# Altium project QUTMS_Shutdownboard_V2.PrjPcb (part 1 of 2)
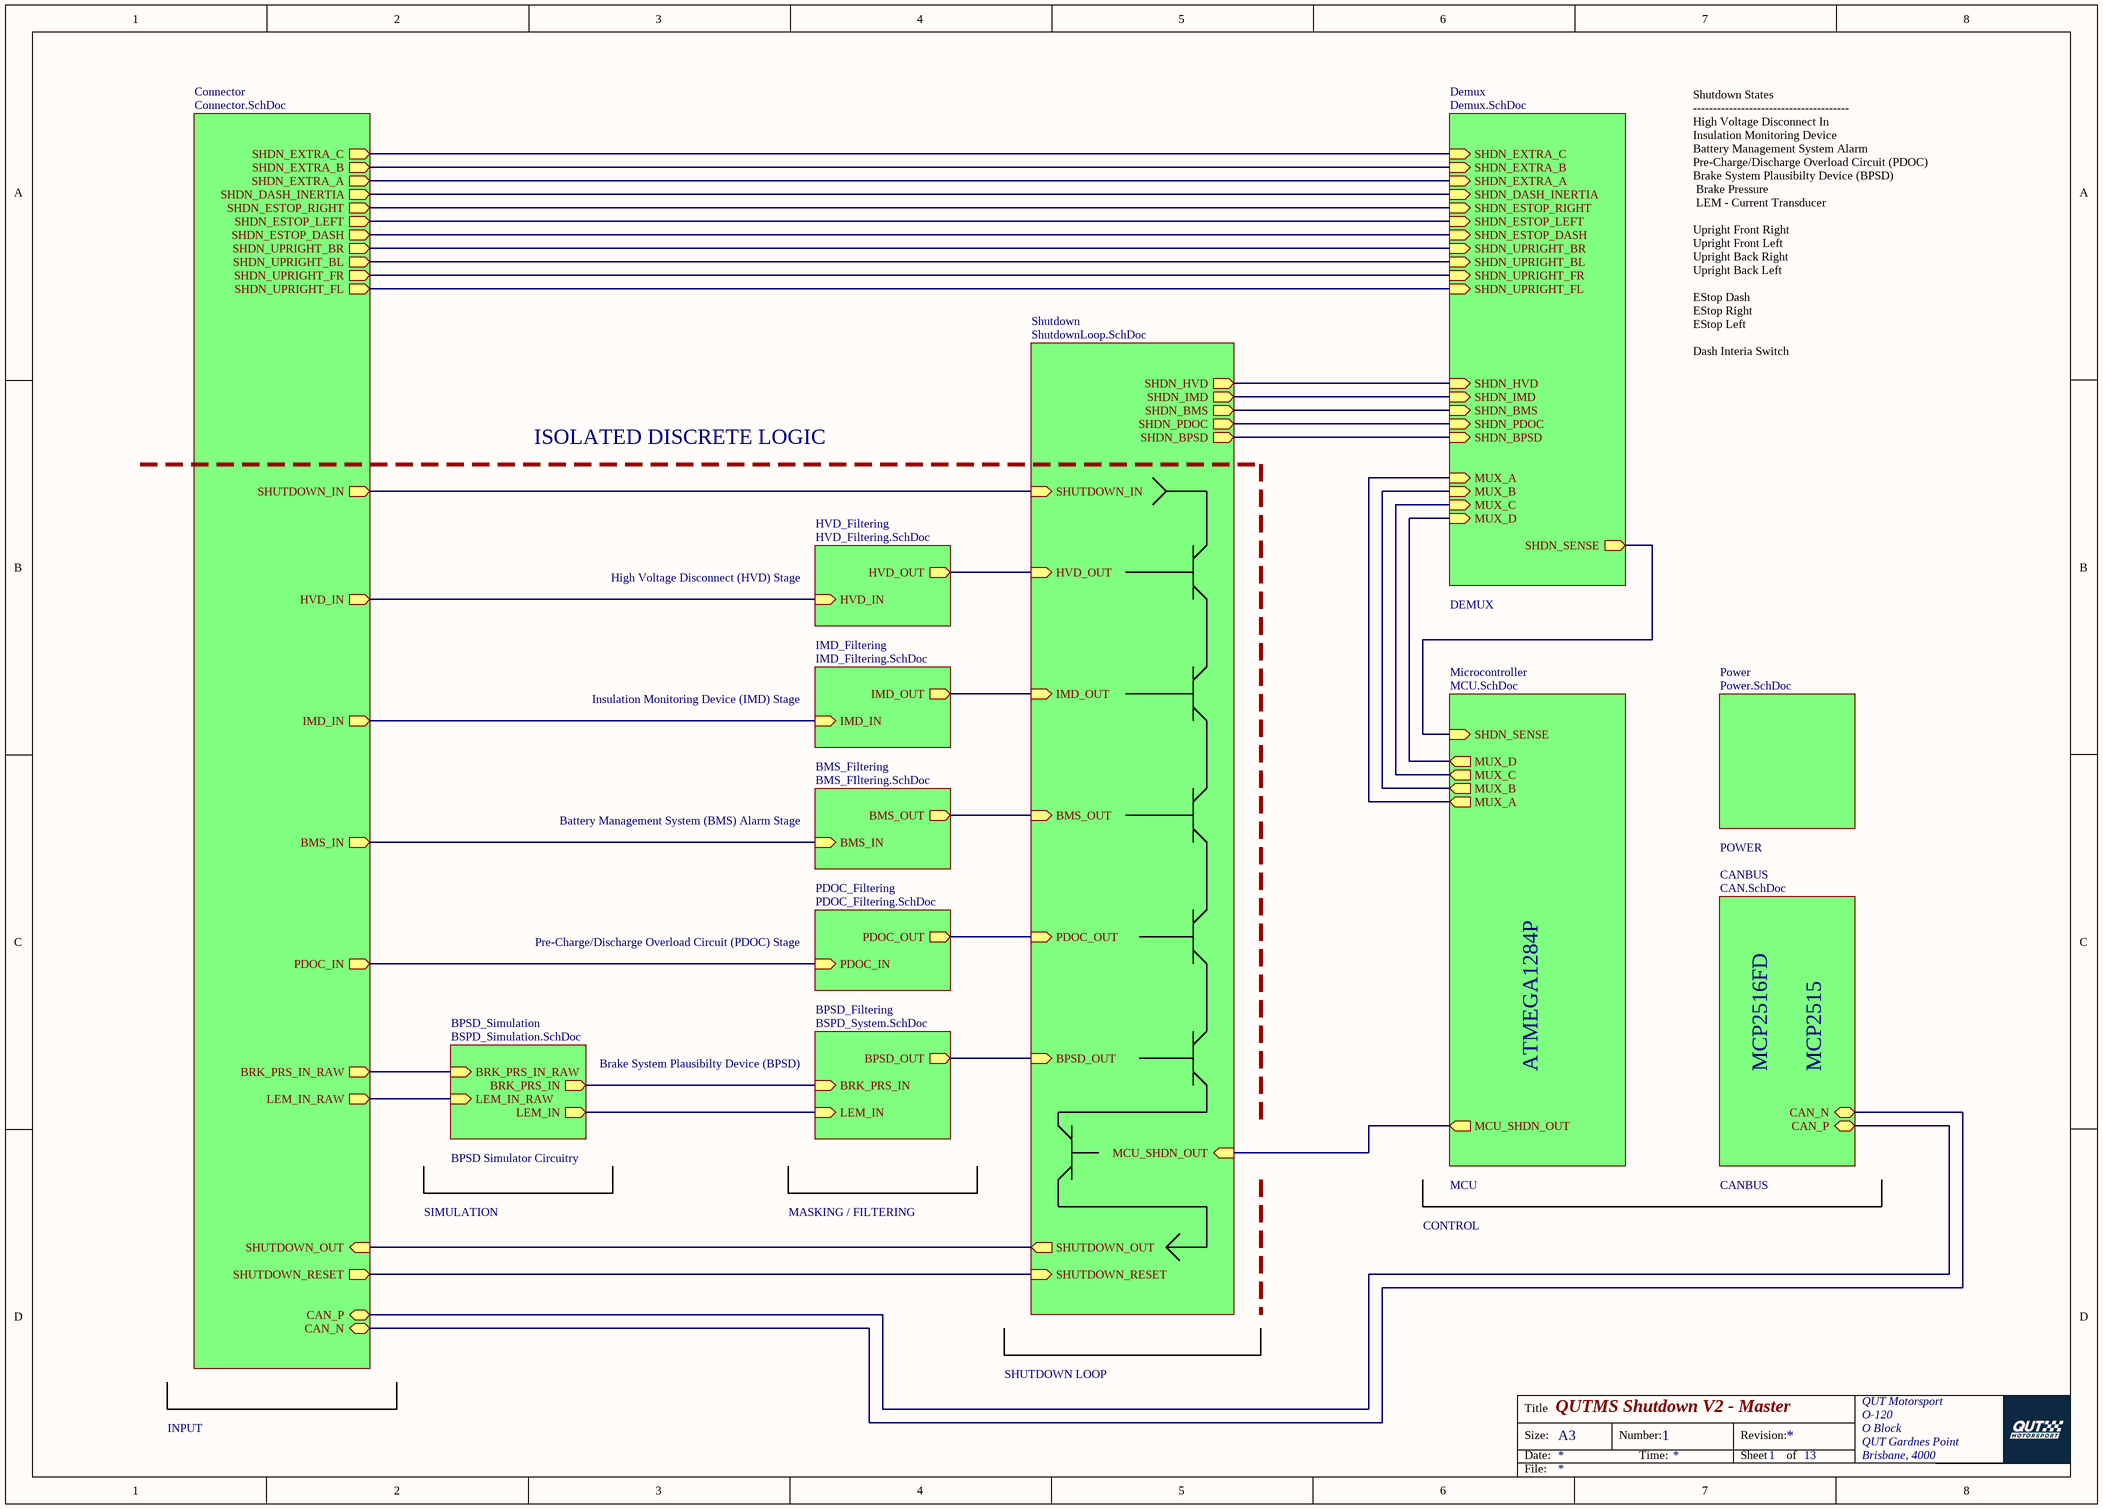
[diagram p0: Master.SchDoc]
13 sheets, 127 parts. Net scope: hierarchical (ports join the sheet entries above them; power ports are global).
Board file: ShutdownBoard.PcbDoc
Sheets:
  Master.SchDoc
    HVD_Filtering = HVD_Filtering.SchDoc
    IMD_Filtering = IMD_Filtering.SchDoc
    BMS_Filtering = BMS_FIltering.SchDoc
    PDOC_Filtering = PDOC_Filtering.SchDoc
    BPSD_Filtering = BSPD_System.SchDoc
    BPSD_Simulation = BSPD_Simulation.SchDoc
    Connector = Connector.SchDoc
    Shutdown = ShutdownLoop.SchDoc
    Microcontroller = MCU.SchDoc
    CANBUS = CAN.SchDoc
    Power = Power.SchDoc
    Demux = Demux.SchDoc

## Sheet Master.SchDoc: QUTMS Shutdown V2 - Master
size A3; Organization: QUT Motorsport; Address1: O-120; Address2: O Block; Address3: QUT Gardnes Point; Address4: Brisbane, 4000; DocumentNumber: 1; SheetNumber: 1; SheetTotal: 13

### Sub-sheets
BMS_Filtering = BMS_FIltering.SchDoc: BMS_OUT (out), BMS_IN (in)
BPSD_Filtering = BSPD_System.SchDoc: BPSD_OUT (out), BRK_PRS_IN (in), LEM_IN (in)
BPSD_Simulation = BSPD_Simulation.SchDoc: LEM_IN (out), BRK_PRS_IN (out), BRK_PRS_IN_RAW (in), LEM_IN_RAW (in)
CANBUS = CAN.SchDoc: CAN_P (bidir), CAN_N (bidir)
Connector = Connector.SchDoc: LEM_IN_RAW (out), BRK_PRS_IN_RAW (out), PDOC_IN (out), BMS_IN (out), IMD_IN (out), HVD_IN (out), SHUTDOWN_IN (out), SHUTDOWN_OUT (in), SHUTDOWN_RESET (out), SHDN_UPRIGHT_FL (out), SHDN_UPRIGHT_FR (out), SHDN_UPRIGHT_BL (out), SHDN_UPRIGHT_BR (out), SHDN_ESTOP_LEFT (out), SHDN_ESTOP_RIGHT (out), SHDN_DASH_INERTIA (out), SHDN_EXTRA_B (out), SHDN_EXTRA_A (out), SHDN_ESTOP_DASH (out), SHDN_EXTRA_C (out), CAN_N (bidir), CAN_P (bidir)
Demux = Demux.SchDoc: SHDN_EXTRA_C (in), SHDN_EXTRA_B (in), SHDN_EXTRA_A (in), SHDN_DASH_INERTIA (in), SHDN_ESTOP_RIGHT (in), SHDN_ESTOP_LEFT (in), SHDN_ESTOP_DASH (in), SHDN_UPRIGHT_BR (in), SHDN_UPRIGHT_BL (in), SHDN_UPRIGHT_FR (in), SHDN_UPRIGHT_FL (in), SHDN_HVD (in), SHDN_IMD (in), SHDN_BMS (in), SHDN_PDOC (in), SHDN_BPSD (in), SHDN_SENSE (out), MUX_D (in), MUX_C (in), MUX_B (in), MUX_A (in)
HVD_Filtering = HVD_Filtering.SchDoc: HVD_OUT (out), HVD_IN (in)
IMD_Filtering = IMD_Filtering.SchDoc: IMD_OUT (out), IMD_IN (in)
Microcontroller = MCU.SchDoc: SHDN_SENSE (in), MUX_D (out), MUX_C (out), MUX_B (out), MUX_A (out), MCU_SHDN_OUT (out)
PDOC_Filtering = PDOC_Filtering.SchDoc: PDOC_OUT (out), PDOC_IN (in)
Power = Power.SchDoc: no entries
Shutdown = ShutdownLoop.SchDoc: HVD_OUT (in), IMD_OUT (in), BMS_OUT (in), PDOC_OUT (in), BPSD_OUT (in), SHUTDOWN_IN (in), SHUTDOWN_OUT (out), SHUTDOWN_RESET (in), SHDN_HVD (out), SHDN_IMD (out), SHDN_BMS (out), SHDN_PDOC (out), SHDN_BPSD (out), MCU_SHDN_OUT (in)

### Nets
BMS_IN: sheet BMS_Filtering/BMS_IN, sheet Connector/BMS_IN
BRK_PRS_IN_RAW: sheet BPSD_Simulation/BRK_PRS_IN_RAW, sheet Connector/BRK_PRS_IN_RAW
CAN_N: sheet Connector/CAN_N, sheet CANBUS/CAN_N
CAN_P: sheet Connector/CAN_P, sheet CANBUS/CAN_P
HVD_IN: sheet HVD_Filtering/HVD_IN, sheet Connector/HVD_IN
IMD_IN: sheet IMD_Filtering/IMD_IN, sheet Connector/IMD_IN
LEM_IN_RAW: sheet BPSD_Simulation/LEM_IN_RAW, sheet Connector/LEM_IN_RAW
PDOC_IN: sheet PDOC_Filtering/PDOC_IN, sheet Connector/PDOC_IN
SHDN_BMS: sheet Shutdown/SHDN_BMS, sheet Demux/SHDN_BMS
SHDN_BPSD: sheet Shutdown/SHDN_BPSD, sheet Demux/SHDN_BPSD
SHDN_DASH_INERTIA: sheet Connector/SHDN_DASH_INERTIA, sheet Demux/SHDN_DASH_INERTIA
SHDN_ESTOP_DASH: sheet Connector/SHDN_ESTOP_DASH, sheet Demux/SHDN_ESTOP_DASH
SHDN_ESTOP_LEFT: sheet Connector/SHDN_ESTOP_LEFT, sheet Demux/SHDN_ESTOP_LEFT
SHDN_ESTOP_RIGHT: sheet Connector/SHDN_ESTOP_RIGHT, sheet Demux/SHDN_ESTOP_RIGHT
SHDN_EXTRA_A: sheet Connector/SHDN_EXTRA_A, sheet Demux/SHDN_EXTRA_A
SHDN_EXTRA_B: sheet Connector/SHDN_EXTRA_B, sheet Demux/SHDN_EXTRA_B
SHDN_EXTRA_C: sheet Connector/SHDN_EXTRA_C, sheet Demux/SHDN_EXTRA_C
SHDN_HVD: sheet Shutdown/SHDN_HVD, sheet Demux/SHDN_HVD
SHDN_IMD: sheet Shutdown/SHDN_IMD, sheet Demux/SHDN_IMD
SHDN_PDOC: sheet Shutdown/SHDN_PDOC, sheet Demux/SHDN_PDOC
SHDN_UPRIGHT_BL: sheet Connector/SHDN_UPRIGHT_BL, sheet Demux/SHDN_UPRIGHT_BL
SHDN_UPRIGHT_BR: sheet Connector/SHDN_UPRIGHT_BR, sheet Demux/SHDN_UPRIGHT_BR
SHDN_UPRIGHT_FL: sheet Connector/SHDN_UPRIGHT_FL, sheet Demux/SHDN_UPRIGHT_FL
SHDN_UPRIGHT_FR: sheet Connector/SHDN_UPRIGHT_FR, sheet Demux/SHDN_UPRIGHT_FR
SHUTDOWN_IN: sheet Connector/SHUTDOWN_IN, sheet Shutdown/SHUTDOWN_IN
SHUTDOWN_OUT: sheet Connector/SHUTDOWN_OUT, sheet Shutdown/SHUTDOWN_OUT
SHUTDOWN_RESET: sheet Connector/SHUTDOWN_RESET, sheet Shutdown/SHUTDOWN_RESET
NetC1_2: sheet BPSD_Filtering/BRK_PRS_IN, sheet BPSD_Simulation/BRK_PRS_IN
NetC3_2: sheet BPSD_Filtering/LEM_IN, sheet BPSD_Simulation/LEM_IN
NetK1_21: sheet HVD_Filtering/HVD_OUT, sheet Shutdown/HVD_OUT
NetK2_21: sheet IMD_Filtering/IMD_OUT, sheet Shutdown/IMD_OUT
NetK3_21: sheet BMS_Filtering/BMS_OUT, sheet Shutdown/BMS_OUT
NetK4_21: sheet PDOC_Filtering/PDOC_OUT, sheet Shutdown/PDOC_OUT
NetK5_21: sheet BPSD_Filtering/BPSD_OUT, sheet Shutdown/BPSD_OUT
NetK6_21: sheet Shutdown/MCU_SHDN_OUT, sheet Microcontroller/MCU_SHDN_OUT
NetR27_1: sheet Microcontroller/SHDN_SENSE, sheet Demux/SHDN_SENSE
NetU5_10: sheet Microcontroller/MUX_A, sheet Demux/MUX_A
NetU5_11: sheet Microcontroller/MUX_B, sheet Demux/MUX_B
NetU5_13: sheet Microcontroller/MUX_D, sheet Demux/MUX_D
NetU5_14: sheet Microcontroller/MUX_C, sheet Demux/MUX_C

### Notes on the sheet
- Shutdown States
  ---------------------------------------
  High Voltage Disconnect In
  Insulation Monitoring Device
  Battery Management System Alarm
  Pre-Charge/Discharge Overload Circuit (PDOC)
  Brake System Plausibilty Device (BPSD)
  Brake Pressure
  LEM - Current Transducer
  Upright Front Right
  Upright Front Left
  Upright Back Right
  Upright Back Left
  EStop Dash
  EStop Right
  EStop Left
  Dash Interia Switch
- ISOLATED DISCRETE LOGIC
- High Voltage Disconnect (HVD) Stage
- DEMUX
- Insulation Monitoring Device (IMD) Stage
- Battery Management System (BMS) Alarm Stage
- POWER
- Pre-Charge/Discharge Overload Circuit (PDOC) Stage
- Brake System Plausibilty Device (BPSD)
- ATMEGA1284P
- MCP2516FD
- MCP2515
- BPSD Simulator Circuitry
- MCU
- CANBUS
- SIMULATION
- MASKING / FILTERING
- CONTROL
- SHUTDOWN LOOP
- INPUT
- Title
- Size:
- Date:
- A3
- Number:
- Time:
- Revision:
- Sheet
- of
- File:

## Sheet HVD_Filtering.SchDoc: QUTMS Shutdown V2 - HVD_Filtering
size A4; Author: Jonn Dillon; Organization: QUT Motorsport; Address1: O-120; Address2: O Block; Address3: QUT Gardens Point; Address4: Brisbane, 4000; DocumentNumber: 5; SheetNumber: 5; SheetTotal: 13
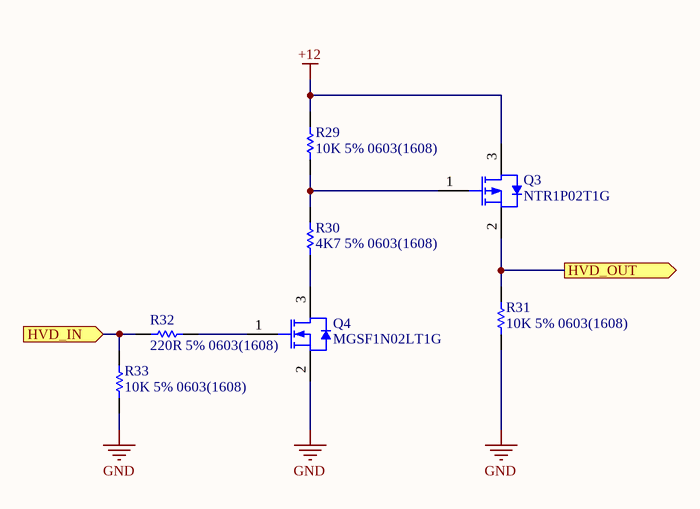
[diagram p1: HVD_Filtering.SchDoc]

### Parts
Q3  NTR1P02T1G  [ONSC-SOT-23-3-318-08_V]
Q4  MGSF1N02LT1G  [ONSC-SOT-23-3-318-08_V]
R29  10K 5% 0603(1608)  [RESC0603(1608)_N]
R30  4K7 5% 0603(1608)  [RESC0603(1608)_N]
R31  10K 5% 0603(1608)  [RESC0603(1608)_N]
R32  220R 5% 0603(1608)  [RESC0603(1608)_M]
R33  10K 5% 0603(1608)  [RESC0603(1608)_N]

### Ports
HVD_IN (in), HVD_OUT (out)

### Nets
+12: Q3.3(D) R29.2
GND: Q4.2(S) R31.1 R33.1
HVD_IN: R32.1 R33.2 ; port HVD_IN
NetK1_21: Q3.2(S) R31.2 ; port HVD_OUT
NetQ3_1: Q3.1(G) R29.1 R30.2
NetQ4_1: Q4.1(G) R32.2
NetQ4_3: Q4.3(D) R30.1

### Notes on the sheet
- Title
- Size:
- Date:
- A4
- Number:
- Time:
- Revision:
- Sheet
- of
- File:

### Library data of the parts
Q3 = CMP-1058-00751-1: Power MOSFET, -20 V, -1 A, P-Channel, 3-Pin SOT-23, Pb-Free, Tape and Reel; Manufacturer: On Semiconductor; Ciss Typ (pF): 165; Coss Typ (pF): 110; Qrr Typ (nC): 8; Crss Typ (pF): 35; V(BR)DSS Min (V): 20; VGS(th) Max (V): 2.3; Configuration: Single; ID Max (A): 1; Channel Polarity: P Channel; PD Max (W): 0.4; ComponentLink2Description: Datasheet; ComponentLink3URL: http://www.onsemi.cn/pub_link/Collateral/318-08.PDF; PackageReference: SOT-23-3-318-08; ComponentLink1Description: Manufacturer URL; Mounting Technology: Surface Mount; RoHS: Pb-Free; Package Type: SOT-23-3; DatasheetVersion: Rev. 7; PackageVersion: Rev. AP, 11/2009; Packing: Tape and Reel; PackageDescription: 3-Pin Small Outline Transistor, Body 2.92 x 1.3 mm, Pitch 0.95 mm; VGS Max (V): 20; ComponentLink3Description: Package Specification; ComponentLink1URL: http://www.onsemi.com/; PartNumber: NTR1P02T1G; ComponentLink2URL: http://www.onsemi.cn/pub_link/Collateral/NTR1P02T1-D.PDF
Q4 = CMP-1058-00777-1: Power MOSFET, 750 mA, 20 V, N-Channel, 3-Pin SOT-23, Pb-Free, Tape and Reel; Manufacturer: On Semiconductor; Crss Typ (pF): 45; Ciss Typ (pF): 125; VGS(th) Max (V): 2.4; Coss Typ (pF): 120; PD Max (W): 0.4; VGS Max (V): 20; Configuration: Single; Channel Polarity: N Channel; ID Max (A): 0.75; PackageReference: SOT-23-3-318-08; ComponentLink2Description: Datasheet; PackageVersion: Rev. AP, 11/2009; ComponentLink1URL: http://www.onsemi.com/; RoHS: Pb-Free; Mounting Technology: Surface Mount; Package Type: SOT-23-3; ComponentLink1Description: Manufacturer URL; V(BR)DSS Min (V): 20; PackageDescription: 3-Pin Small Outline Transistor, Body 2.92 x 1.3 mm, Pitch 0.95 mm; Packing: Tape and Reel; PartNumber: MGSF1N02LT1G; DatasheetVersion: Rev. 6; ComponentLink2URL: http://www.onsemi.cn/pub_link/Collateral/MGSF1N02LT1-D.PDF; ComponentLink3URL: http://www.onsemi.cn/pub_link/Collateral/318-08.PDF; ComponentLink3Description: Package Specification
R29 R31 R33 = CMP-1012-00098-1: 10K 0.1W 5% 0603 (1608 Metric)  SMD; Case-EIA: 0603; Value: 10000.00 Ohm; Case-Metric: 1608; Technology: SMT; Tolerance: 5 %; Power: 0.1 W
R30 = CMP-1012-00090-1: 4K7 0.1W 5% 0603 (1608 Metric)  SMD; Case-Metric: 1608; Value: 4700.00 Ohm; Case-EIA: 0603; Tolerance: 5 %; Technology: SMT; Power: 0.1 W
R32 = CMP-1012-00058-1: 220R 0.1W 5% 0603 (1608 Metric)  SMD; Case-EIA: 0603; Case-Metric: 1608; Value: 220.00 Ohm; Technology: SMT; Power: 0.1 W; Tolerance: 5 %

## Sheet IMD_Filtering.SchDoc: QUTMS Shutdown V2 - IMD_Filtering
size A4; Author: Jonn Dillon; Organization: QUT Motorsport; Address1: O-120; Address2: O Block; Address3: QUT Gardens Point; Address4: Brisbane, 4000; DocumentNumber: 6; SheetNumber: 6; SheetTotal: 13
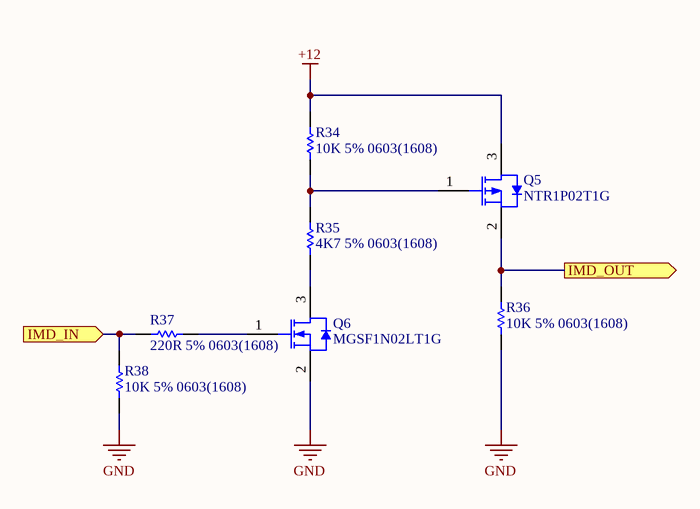
[diagram p2: IMD_Filtering.SchDoc]

### Parts
Q5  NTR1P02T1G  [ONSC-SOT-23-3-318-08_V]
Q6  MGSF1N02LT1G  [ONSC-SOT-23-3-318-08_V]
R34  10K 5% 0603(1608)  [RESC0603(1608)_N]
R35  4K7 5% 0603(1608)  [RESC0603(1608)_N]
R36  10K 5% 0603(1608)  [RESC0603(1608)_N]
R37  220R 5% 0603(1608)  [RESC0603(1608)_M]
R38  10K 5% 0603(1608)  [RESC0603(1608)_N]

### Ports
IMD_IN (in), IMD_OUT (out)

### Nets
+12: Q5.3(D) R34.2
GND: Q6.2(S) R36.1 R38.1
IMD_IN: R37.1 R38.2 ; port IMD_IN
NetK2_21: Q5.2(S) R36.2 ; port IMD_OUT
NetQ5_1: Q5.1(G) R34.1 R35.2
NetQ6_1: Q6.1(G) R37.2
NetQ6_3: Q6.3(D) R35.1

### Notes on the sheet
- Title
- Size:
- Date:
- A4
- Number:
- Time:
- Revision:
- Sheet
- of
- File:

### Library data of the parts
Q5 = CMP-1058-00751-1: as Q3 on sheet HVD_Filtering; ComponentLink2Description: Datasheet; ComponentLink3URL: http://www.onsemi.cn/pub_link/Collateral/318-08.PDF; PackageReference: SOT-23-3-318-08; ComponentLink1Description: Manufacturer URL; Mounting Technology: Surface Mount; RoHS: Pb-Free; Package Type: SOT-23-3; DatasheetVersion: Rev. 7; PackageVersion: Rev. AP, 11/2009; Packing: Tape and Reel; PackageDescription: 3-Pin Small Outline Transistor, Body 2.92 x 1.3 mm, Pitch 0.95 mm; VGS Max (V): 20; ComponentLink3Description: Package Specification; ComponentLink1URL: http://www.onsemi.com/; PartNumber: NTR1P02T1G; ComponentLink2URL: http://www.onsemi.cn/pub_link/Collateral/NTR1P02T1-D.PDF
Q6 = CMP-1058-00777-1: as Q4 on sheet HVD_Filtering; PackageReference: SOT-23-3-318-08; ComponentLink2Description: Datasheet; PackageVersion: Rev. AP, 11/2009; ComponentLink1URL: http://www.onsemi.com/; RoHS: Pb-Free; Mounting Technology: Surface Mount; Package Type: SOT-23-3; ComponentLink1Description: Manufacturer URL; V(BR)DSS Min (V): 20; PackageDescription: 3-Pin Small Outline Transistor, Body 2.92 x 1.3 mm, Pitch 0.95 mm; Packing: Tape and Reel; PartNumber: MGSF1N02LT1G; DatasheetVersion: Rev. 6; ComponentLink2URL: http://www.onsemi.cn/pub_link/Collateral/MGSF1N02LT1-D.PDF; ComponentLink3URL: http://www.onsemi.cn/pub_link/Collateral/318-08.PDF; ComponentLink3Description: Package Specification
R34 R36 R38 = CMP-1012-00098-1: as R29 on sheet HVD_Filtering; Technology: SMT; Tolerance: 5 %; Power: 0.1 W
R35 = CMP-1012-00090-1: as R30 on sheet HVD_Filtering; Tolerance: 5 %; Technology: SMT; Power: 0.1 W
R37 = CMP-1012-00058-1: as R32 on sheet HVD_Filtering; Technology: SMT; Power: 0.1 W; Tolerance: 5 %

## Sheet BMS_FIltering.SchDoc: QUTMS Shutdown V2 - BMS_Filtering
size A4; Author: Jonn Dillon; Organization: QUT Motorsport; Address1: O-120; Address2: O Block; Address3: QUT Gardens Point; Address4: Brisbane, 4000; DocumentNumber: 7; SheetNumber: 7; SheetTotal: 13
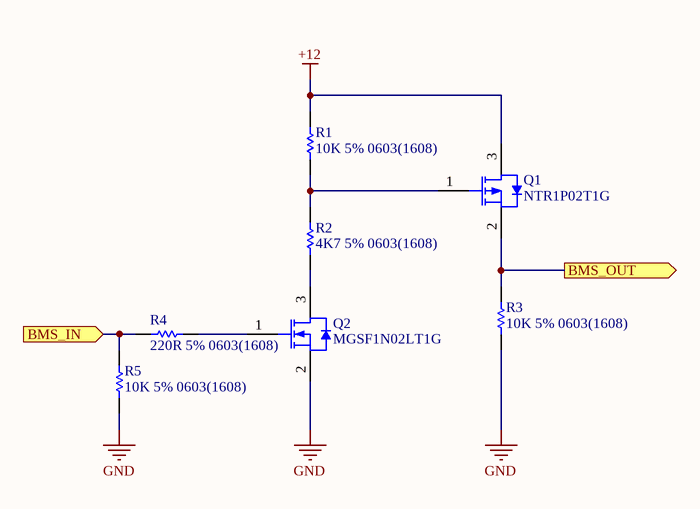
[diagram p3: BMS_FIltering.SchDoc]

### Parts
Q1  NTR1P02T1G  [ONSC-SOT-23-3-318-08_V]
Q2  MGSF1N02LT1G  [ONSC-SOT-23-3-318-08_V]
R1  10K 5% 0603(1608)  [RESC0603(1608)_N]
R2  4K7 5% 0603(1608)  [RESC0603(1608)_N]
R3  10K 5% 0603(1608)  [RESC0603(1608)_N]
R4  220R 5% 0603(1608)  [RESC0603(1608)_M]
R5  10K 5% 0603(1608)  [RESC0603(1608)_N]

### Ports
BMS_IN (in), BMS_OUT (out)

### Nets
+12: Q1.3(D) R1.2
GND: Q2.2(S) R3.1 R5.1
BMS_IN: R4.1 R5.2 ; port BMS_IN
NetK3_21: Q1.2(S) R3.2 ; port BMS_OUT
NetQ1_1: Q1.1(G) R1.1 R2.2
NetQ2_1: Q2.1(G) R4.2
NetQ2_3: Q2.3(D) R2.1

### Notes on the sheet
- Title
- Size:
- Date:
- A4
- Number:
- Time:
- Revision:
- Sheet
- of
- File:

### Library data of the parts
Q1 = CMP-1058-00751-1: as Q3 on sheet HVD_Filtering; ComponentLink2Description: Datasheet; ComponentLink3URL: http://www.onsemi.cn/pub_link/Collateral/318-08.PDF; PackageReference: SOT-23-3-318-08; ComponentLink1Description: Manufacturer URL; Mounting Technology: Surface Mount; RoHS: Pb-Free; Package Type: SOT-23-3; DatasheetVersion: Rev. 7; PackageVersion: Rev. AP, 11/2009; Packing: Tape and Reel; PackageDescription: 3-Pin Small Outline Transistor, Body 2.92 x 1.3 mm, Pitch 0.95 mm; VGS Max (V): 20; ComponentLink3Description: Package Specification; ComponentLink1URL: http://www.onsemi.com/; PartNumber: NTR1P02T1G; ComponentLink2URL: http://www.onsemi.cn/pub_link/Collateral/NTR1P02T1-D.PDF
Q2 = CMP-1058-00777-1: as Q4 on sheet HVD_Filtering; PackageReference: SOT-23-3-318-08; ComponentLink2Description: Datasheet; PackageVersion: Rev. AP, 11/2009; ComponentLink1URL: http://www.onsemi.com/; RoHS: Pb-Free; Mounting Technology: Surface Mount; Package Type: SOT-23-3; ComponentLink1Description: Manufacturer URL; V(BR)DSS Min (V): 20; PackageDescription: 3-Pin Small Outline Transistor, Body 2.92 x 1.3 mm, Pitch 0.95 mm; Packing: Tape and Reel; PartNumber: MGSF1N02LT1G; DatasheetVersion: Rev. 6; ComponentLink2URL: http://www.onsemi.cn/pub_link/Collateral/MGSF1N02LT1-D.PDF; ComponentLink3URL: http://www.onsemi.cn/pub_link/Collateral/318-08.PDF; ComponentLink3Description: Package Specification
R1 R3 R5 = CMP-1012-00098-1: as R29 on sheet HVD_Filtering; Technology: SMT; Tolerance: 5 %; Power: 0.1 W
R2 = CMP-1012-00090-1: as R30 on sheet HVD_Filtering; Tolerance: 5 %; Technology: SMT; Power: 0.1 W
R4 = CMP-1012-00058-1: as R32 on sheet HVD_Filtering; Technology: SMT; Power: 0.1 W; Tolerance: 5 %

## Sheet PDOC_Filtering.SchDoc: QUTMS Shutdown V2 - PDOC_Filtering
size A4; Author: Jonn Dillon; Organization: QUT Motorsport; Address1: O-120; Address2: O Block; Address3: QUT Gardens Point; Address4: Brisbane, 4000; DocumentNumber: 8; SheetNumber: 8; SheetTotal: 13
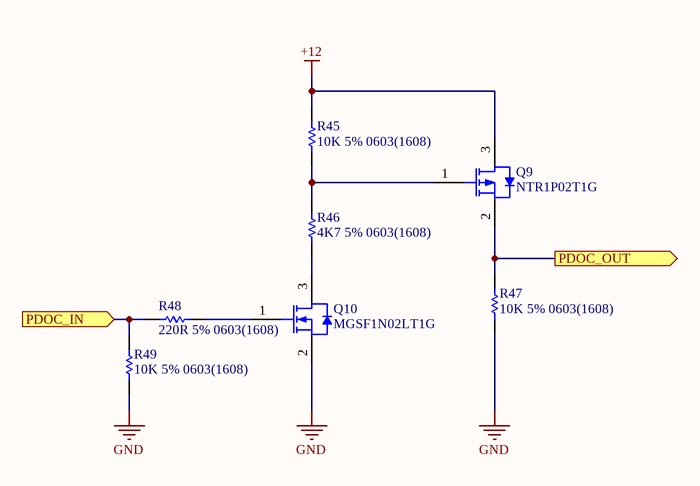
[diagram p4: PDOC_Filtering.SchDoc]

### Parts
Q9  NTR1P02T1G  [ONSC-SOT-23-3-318-08_V]
Q10  MGSF1N02LT1G  [ONSC-SOT-23-3-318-08_V]
R45  10K 5% 0603(1608)  [RESC0603(1608)_N]
R46  4K7 5% 0603(1608)  [RESC0603(1608)_N]
R47  10K 5% 0603(1608)  [RESC0603(1608)_N]
R48  220R 5% 0603(1608)  [RESC0603(1608)_M]
R49  10K 5% 0603(1608)  [RESC0603(1608)_N]

### Ports
PDOC_IN (in), PDOC_OUT (out)

### Nets
+12: Q9.3(D) R45.2
GND: Q10.2(S) R47.1 R49.1
PDOC_IN: R48.1 R49.2 ; port PDOC_IN
NetK4_21: Q9.2(S) R47.2 ; port PDOC_OUT
NetQ9_1: Q9.1(G) R45.1 R46.2
NetQ10_1: Q10.1(G) R48.2
NetQ10_3: Q10.3(D) R46.1

### Notes on the sheet
- Title
- Size:
- Date:
- A4
- Number:
- Time:
- Revision:
- Sheet
- of
- File:

### Library data of the parts
Q9 = CMP-1058-00751-1: as Q3 on sheet HVD_Filtering; ComponentLink2Description: Datasheet; ComponentLink3URL: http://www.onsemi.cn/pub_link/Collateral/318-08.PDF; PackageReference: SOT-23-3-318-08; ComponentLink1Description: Manufacturer URL; Mounting Technology: Surface Mount; RoHS: Pb-Free; Package Type: SOT-23-3; DatasheetVersion: Rev. 7; PackageVersion: Rev. AP, 11/2009; Packing: Tape and Reel; PackageDescription: 3-Pin Small Outline Transistor, Body 2.92 x 1.3 mm, Pitch 0.95 mm; VGS Max (V): 20; ComponentLink3Description: Package Specification; ComponentLink1URL: http://www.onsemi.com/; PartNumber: NTR1P02T1G; ComponentLink2URL: http://www.onsemi.cn/pub_link/Collateral/NTR1P02T1-D.PDF
Q10 = CMP-1058-00777-1: as Q4 on sheet HVD_Filtering; PackageReference: SOT-23-3-318-08; ComponentLink2Description: Datasheet; PackageVersion: Rev. AP, 11/2009; ComponentLink1URL: http://www.onsemi.com/; RoHS: Pb-Free; Mounting Technology: Surface Mount; Package Type: SOT-23-3; ComponentLink1Description: Manufacturer URL; V(BR)DSS Min (V): 20; PackageDescription: 3-Pin Small Outline Transistor, Body 2.92 x 1.3 mm, Pitch 0.95 mm; Packing: Tape and Reel; PartNumber: MGSF1N02LT1G; DatasheetVersion: Rev. 6; ComponentLink2URL: http://www.onsemi.cn/pub_link/Collateral/MGSF1N02LT1-D.PDF; ComponentLink3URL: http://www.onsemi.cn/pub_link/Collateral/318-08.PDF; ComponentLink3Description: Package Specification
R45 R47 R49 = CMP-1012-00098-1: as R29 on sheet HVD_Filtering; Technology: SMT; Tolerance: 5 %; Power: 0.1 W
R46 = CMP-1012-00090-1: as R30 on sheet HVD_Filtering; Tolerance: 5 %; Technology: SMT; Power: 0.1 W
R48 = CMP-1012-00058-1: as R32 on sheet HVD_Filtering; Technology: SMT; Power: 0.1 W; Tolerance: 5 %

## Sheet BSPD_System.SchDoc: QUTMS Shutdown V2 - BSPD_System
size A4; Author: Jonn Dillon; Organization: QUT Motorsport; Address1: O-120; Address2: O Block; Address3: QUT Gardens Point; Address4: Brisbane, 4000; DocumentNumber: 9; SheetNumber: 9; SheetTotal: 13
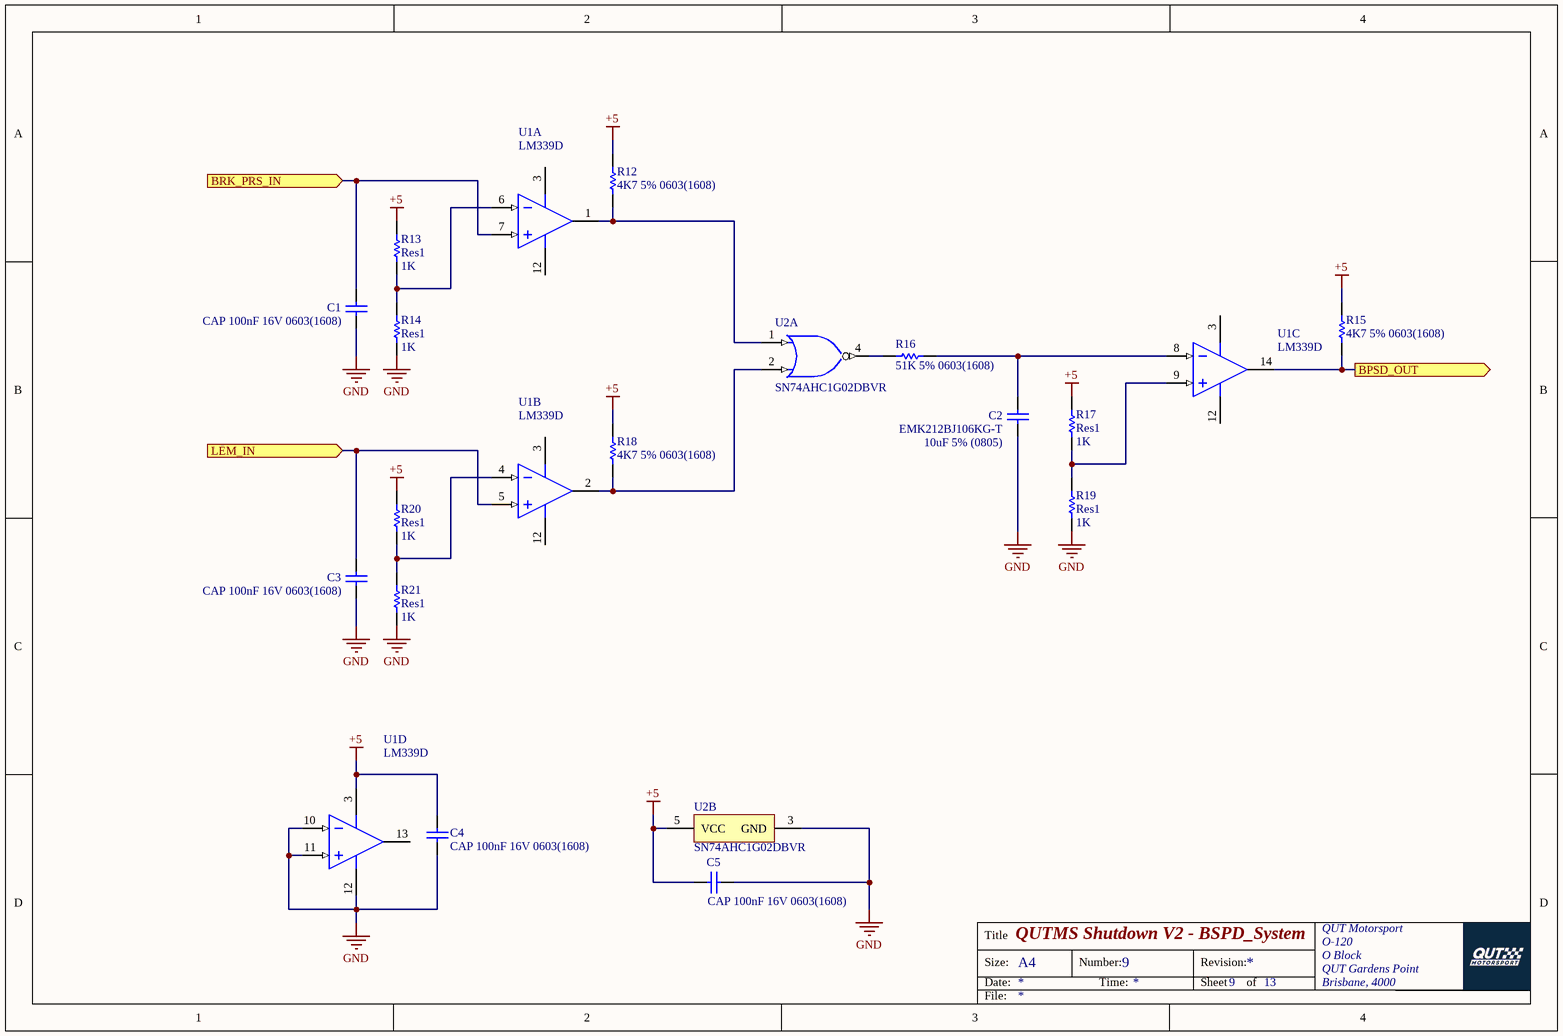
[diagram p5: BSPD_System.SchDoc]

### Parts
C1  CAP 100nF 16V 0603(1608)  [CAPC0603(1608)100_M]
C2  EMK212BJ106KG-T  [CAPC2013X135X50ML10T25]
C3  CAP 100nF 16V 0603(1608)  [CAPC0603(1608)100_M]
C4  CAP 100nF 16V 0603(1608)  [CAPC0603(1608)100_M]
C5  CAP 100nF 16V 0603(1608)  [CAPC0603(1608)100_M]
R12  4K7 5% 0603(1608)  [RESC0603(1608)_N]
R13  Res1  value 1K  [AXIAL-0.3]
R14  Res1  value 1K  [AXIAL-0.3]
R15  4K7 5% 0603(1608)  [RESC0603(1608)_N]
R16  51K 5% 0603(1608)  [RESC0603(1608)_M]
R17  Res1  value 1K  [AXIAL-0.3]
R18  4K7 5% 0603(1608)  [RESC0603(1608)_N]
R19  Res1  value 1K  [AXIAL-0.3]
R20  Res1  value 1K  [AXIAL-0.3]
R21  Res1  value 1K  [AXIAL-0.3]
U1  LM339D  [D0014A_L]  (parts A,B,C,D of 4)
U2  SN74AHC1G02DBVR  [DBV0005A_L]  (parts A,B of 2)

### Ports
BPSD_OUT (out), BRK_PRS_IN (in), LEM_IN (in)

### Nets
+5: C4.2 C5.1 R12.2 R13.1 R15.2 R17.2 R18.2 R20.2 U1.3(VCC) U2.5(VCC)
GND: C1.1 C2.1 C3.1 C4.1 C5.2 R14.2 R19.1 R21.1 U1.10(IN4-) U1.11(IN4+) U1.12(GND) U2.3(GND)
NetC1_2: C1.2 U1.7(IN1+) ; port BRK_PRS_IN
NetC2_2: C2.2 R16.2 U1.8(IN3-)
NetC3_2: C3.2 U1.5(IN2+) ; port LEM_IN
NetK5_21: R15.1 U1.14(OUT3) ; port BPSD_OUT
NetR12_1: R12.1 U1.1(OUT1) U2.1(A)
NetR13_2: R13.2 R14.1 U1.6(IN1-)
NetR16_1: R16.1 U2.4(Y)
NetR17_1: R17.1 R19.2 U1.9(IN3+)
NetR18_1: R18.1 U1.2(OUT2) U2.2(B)
NetR20_1: R20.1 R21.2 U1.4(IN2-)

Not connected (* = marked no-connect by the designer): U1 13(OUT4)

### Notes on the sheet
- (near C2) 10uF 5% (0805)
- Title
- Size:
- Date:
- A4
- Number:
- Time:
- Revision:
- Sheet
- of
- File:

### Library data of the parts
C1 C3-C5 = CMP-1035-02583-1: CAP 100nF 16V ±5% 0603 (1608 Metric) Thickness 1mm SMD; Tolerance: Â±5%; Case-Metric: 1608; Case-EIA: 0603; Rated Voltage: 16 V; Max Thickness: 1 mm; Technology: SMT; Value: 100nF
C2 = CMP-2000-05449-1: Chip Capacitor, 10 uF, +/- 10%, 16 V, -25 to 85 degC, 0805 (2012 Metric), RoHS, Tape and Reel; PCN Part Number: X5R,X7RDielectrics23/Jan/2008; Manufacturer: Taiyo Yuden; Other Names: 587-1295-1; Voltage - Rated: 16V; Catalog Drawings: xMKSeries_0805_1.25; Online Catalog: MSeries; Capacitance: 10µF; Temperature Coefficient: X5R; Kits: 587-1797-KIT-ND-KITCAPCERHICAP0603&0805S; Category: Capacitors; Package Description: 2-Pin Surface Mount Device, Body 2 x 1.25 mm; Datasheet Version: Sep-12; Package / Case: 0805(2012Metric); Tolerance: ±10%; Height - Seated (Max): -; Size / Dimension: 0.079"Lx0.049"W(2.00mmx1.25mm); Lead Style: -; Packaging: CutTape(CT); Datasheet URL: https://datasheet.ciiva.com/26871/getdatasheetpartid-638258-26871376.pdf; Applications: GeneralPurpose; Mounting Type: SurfaceMount,MLCC; Package Reference: 805; Operating Temperature: -55degC~85degC; Thickness (Max): 0.053"(1.35mm); Ratings: -; Features: -; Standard Package: 1; Series: M; Family: CeramicCapacitors; Lead Spacing: -; Manufacturer URL: http://www.t-yuden.com/
R12 R15 R18 = CMP-1012-00090-1: as R30 on sheet HVD_Filtering; Tolerance: 5 %; Technology: SMT; Power: 0.1 W
R13 R14 R17 R19-R21 = Res1: Resistor; Published: 8-Jun-2000; LatestRevisionDate: 17-Jul-2002; LatestRevisionNote: Re-released for DXP Platform.; PackageReference: AXIAL-0.3; Publisher: Altium Limited; PackageDescription: Axial Device, Thru-Hole; 2 Leads; 0.3 in Pin Spacing
R16 = CMP-1012-00115-1: 51K 0.1W 5% 0603 (1608 Metric)  SMD; Case-EIA: 0603; Case-Metric: 1608; Value: 51000.00 Ohm; Power: 0.1 W; Technology: SMT; Tolerance: 5 %
U1 = CMP-2000-06548-1: Quad Differential Comparator, 2 to 30 V, 0 to 70 degC, 14-pin SOIC (D14), Green (RoHS & no Sb/Br), Tube; Manufacturer: Texas Instruments; Response Time: 300ns; No. of Comparators: 4; Package Version: 4040047-5/M, 06/2011; IC Output Type: CMOS,MOS,TTL; No. of Pins: 14Pins; Supply Voltage Range: 2Vto36V,±1Vto±18V; Product Range: -; Mounting Technology: SurfaceMount; Operating Temperature Min: 0°C; Package URL: http://www.ti.com/lit/ml/mpds177g/mpds177g.pdf; Automotive Qualification Standard: -; Package Description: 14-Pin Small Outline Integrated Circuit, Body 8.65 x 3.9 mm, Pitch 1.27 mm; Comparator Type: Differential; Manufacturer URL: http://www.ti.com/; Comparator Case Style: SOIC; Packaging: CutTape; Package Reference: D14; Datasheet URL: http://www.ti.com/general/docs/lit/getliterature.tsp?genericPartNumber=LM339&fileType=pdf; Datasheet Version: Rev. T, 06/2015; Operating Temperature Max: 70°C
U2 = CMP-0859-00024-3: Single 2-Input Positive-NOR Gate, DBV0005A, LARGE T&R; Manufacturer: Texas Instruments; Output Drive (IOL/IOH)(Max)(mA): 50/-50; Sub-Family: NAND Gate; Gate Type: NOR; Output Type: CMOS; 3-State Output: No; Voltage(Nom)(V): 3.3,5; tpd @ Nom Voltage(Max)(ns): 11.4,7.5; Bits(#): 1; VCC(Max)(V): 5.5; ICC @ Nom Voltage(Max)(mA): 0.01; VCC(Min)(V): 2; Technology Family: AHC; Rating: Catalog; Logic: True; F @ Nom Voltage(Max)(Mhz): 75; DatasheetVersion: SCLS342M; Input Type: CMOS; Operating Temperature Range(C): -40 to 125,-40 to 85; Generic Part Number: SN74AHC1G02; PackageReference: DBV0005A; Schmitt Trigger: No

## Sheet BSPD_Simulation.SchDoc: QUTMS Shutdown V2 - BSPD_Simulation
size A4; Author: Jonn Dillon; Organization: QUT Motorsport; Address1: O-120; Address2: O Block; Address3: QUT Gardens Point; Address4: Brisbane, 4000; DocumentNumber: 10; SheetNumber: 10; SheetTotal: 13
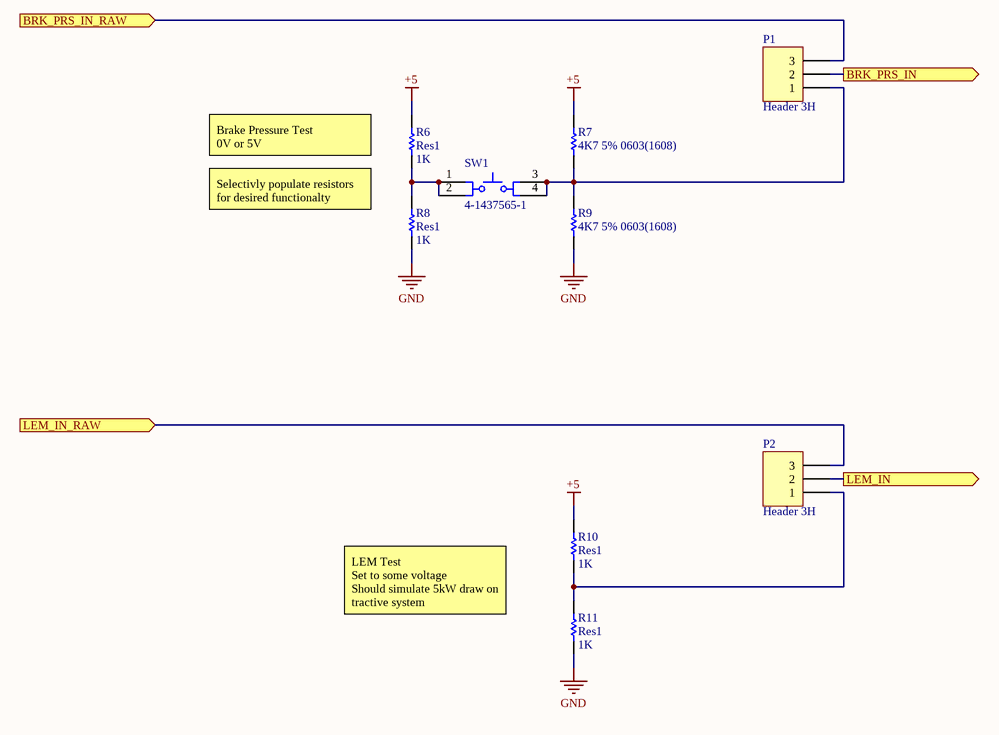
[diagram p6: BSPD_Simulation.SchDoc]

### Parts
P1  Header 3H  [HDR1X3H]
P2  Header 3H  [HDR1X3H]
R6  Res1  value 1K  [AXIAL-0.3]
R7  4K7 5% 0603(1608)  [RESC0603(1608)_N]
R8  Res1  value 1K  [AXIAL-0.3]
R9  4K7 5% 0603(1608)  [RESC0603(1608)_N]
R10  Res1  value 1K  [AXIAL-0.3]
R11  Res1  value 1K  [AXIAL-0.3]
SW1  4-1437565-1  [TECO-4-1437565-1_V]

### Ports
BRK_PRS_IN (out), BRK_PRS_IN_RAW (in), LEM_IN (out), LEM_IN_RAW (in)

### Nets
+5: R6.2 R7.2 R10.2
GND: R8.1 R9.1 R11.1
BRK_PRS_IN_RAW: P1.3 ; port BRK_PRS_IN_RAW
LEM_IN_RAW: P2.3 ; port LEM_IN_RAW
NetC1_2: P1.2 ; port BRK_PRS_IN
NetC3_2: P2.2 ; port LEM_IN
NetP1_1: P1.1 R7.1 R9.2 SW1.3 SW1.4
NetP2_1: P2.1 R10.1 R11.2
NetR6_1: R6.1 R8.2 SW1.1 SW1.2

### Notes on the sheet
- (near R6) Brake Pressure Test
  0V or 5V
- Selectivly populate resistors for desired functionalty
- LEM Test
  Set to some voltage
  Should simulate 5kW draw on tractive system
- Title
- Size:
- Date:
- A4
- Number:
- Time:
- Revision:
- Sheet
- of
- File:

### Library data of the parts
P1 P2 = Header 3H: Header, 3-Pin, Right Angle; LatestRevisionDate: 17-Jul-2002; LatestRevisionNote: Re-released for DXP Platform.; Publisher: Altium Limited
R6 R8 R10 R11 = Res1: Resistor; Published: 8-Jun-2000; LatestRevisionDate: 17-Jul-2002; LatestRevisionNote: Re-released for DXP Platform.; PackageReference: AXIAL-0.3; Publisher: Altium Limited; PackageDescription: Axial Device, Thru-Hole; 2 Leads; 0.3 in Pin Spacing
R7 R9 = CMP-1012-00090-1: as R30 on sheet HVD_Filtering; Tolerance: 5 %; Technology: SMT; Power: 0.1 W
SW1 = CMP-2000-05602-1: Tactile Switch, 50 mA, 12 VDC, -20 to 85 degC, 4-Pin SMD, RoHS, Bulk; Manufacturer: TEConnectivity/AMPBrand; Illumination Type: N/R; Maximum Contact Resistance: 100mOhm; Actuator Style: RoundButton; Actuator Length: 1.4mm; Contact Rating @ Voltage: 0.05@12VDCA; Maximum DC Voltage Rating: 12V; Body Orientation: Straight; Ground Terminal: No; Dielectric Strength: 500VAC; Operating Force: 1.57N; Electrical Life: 100000Cycle; Mechanical Life: N/A; Family: FSMJSMA; Contact Material: CopperAlloy; Type: N/A; RoHS: Yes; Pole Throw Configuration: N/A; Operating Temperature: -20to85C; Minimum Insulation Resistance: 100MOhm; Package Description: 4-Pin Surface Mount Device, Body 6 x 6 mm, Pitch 9.1 mm; Housing Material: N/A; Switch Configuration: N/A; Mounting: SurfaceMount,GullWing; Datasheet URL: https://datasheet.ciiva.com/14635/0900766b80912216-14635826.pdf; Packaging: Bulk; Base Material: N/A; Actuator Color: N/A; Dimension: 6x10x5.25mm; Contact Plating: Silver; Seal Location: N/A; Mounting Technology: SurfaceMount; Part No: 4-1437565-1; Seal Description: N/A; Maximum AC Voltage Rating: N/A; Datasheet Version: 04/2007; Manufacturer URL: http://www.te.com/; Package Reference: 4-1437565-1; Product Weight: N/A

## Sheet Connector.SchDoc: QUTMS Shutdown V2 - Connector
size A4; Organization: QUT Motorsport; Address1: O-120; Address2: O Block; Address3: QUT Gardens Point; Address4: Brisbane, 4000; DocumentNumber: 3; SheetNumber: 3; SheetTotal: 13
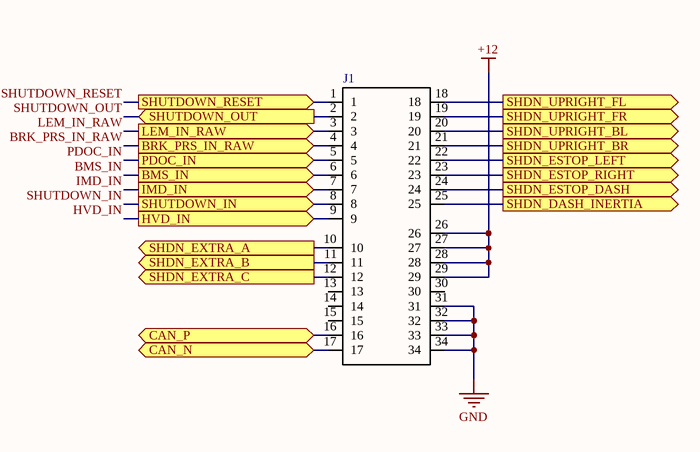
[diagram p7: Connector.SchDoc]

### Parts
J1  6437288-2  [TE_6437288-2]  (value not drawn)

### Ports
BMS_IN (out), BRK_PRS_IN_RAW (out), CAN_N (bidir), CAN_P (bidir), HVD_IN (out), IMD_IN (out), LEM_IN_RAW (out), PDOC_IN (out), SHDN_DASH_INERTIA (out), SHDN_ESTOP_DASH (out), SHDN_ESTOP_LEFT (out), SHDN_ESTOP_RIGHT (out), SHDN_EXTRA_A (out), SHDN_EXTRA_B (out), SHDN_EXTRA_C (out), SHDN_UPRIGHT_BL (out), SHDN_UPRIGHT_BR (out), SHDN_UPRIGHT_FL (out), SHDN_UPRIGHT_FR (out), SHUTDOWN_IN (out), SHUTDOWN_OUT (in), SHUTDOWN_RESET (out)

### Nets
+12: J1.26 J1.27 J1.28 J1.29
GND: J1.31 J1.32 J1.33 J1.34
BMS_IN: J1.6 ; port BMS_IN
BRK_PRS_IN_RAW: J1.4 ; port BRK_PRS_IN_RAW
CAN_N: J1.17 ; port CAN_N
CAN_P: J1.16 ; port CAN_P
HVD_IN: J1.9 ; port HVD_IN
IMD_IN: J1.7 ; port IMD_IN
LEM_IN_RAW: J1.3 ; port LEM_IN_RAW
PDOC_IN: J1.5 ; port PDOC_IN
SHDN_DASH_INERTIA: J1.25 ; port SHDN_DASH_INERTIA
SHDN_ESTOP_DASH: J1.24 ; port SHDN_ESTOP_DASH
SHDN_ESTOP_LEFT: J1.22 ; port SHDN_ESTOP_LEFT
SHDN_ESTOP_RIGHT: J1.23 ; port SHDN_ESTOP_RIGHT
SHDN_EXTRA_A: J1.10 ; port SHDN_EXTRA_A
SHDN_EXTRA_B: J1.11 ; port SHDN_EXTRA_B
SHDN_EXTRA_C: J1.12 ; port SHDN_EXTRA_C
SHDN_UPRIGHT_BL: J1.20 ; port SHDN_UPRIGHT_BL
SHDN_UPRIGHT_BR: J1.21 ; port SHDN_UPRIGHT_BR
SHDN_UPRIGHT_FL: J1.18 ; port SHDN_UPRIGHT_FL
SHDN_UPRIGHT_FR: J1.19 ; port SHDN_UPRIGHT_FR
SHUTDOWN_IN: J1.8 ; port SHUTDOWN_IN
SHUTDOWN_OUT: J1.2 ; port SHUTDOWN_OUT
SHUTDOWN_RESET: J1.1 ; port SHUTDOWN_RESET

Not connected (* = marked no-connect by the designer): J1 13 14 15 30

### Notes on the sheet
- Title
- Size:
- Date:
- A4
- Number:
- Time:
- Revision:
- Sheet
- of
- File:

### Library data of the parts
J1 = 6437288-2: Conn Wire to Board RCP 34 POS 1.5mm Solder RA Thru-Hole Automotive Tube; MF: TE Connectivity; SnapEDA_Link: https://www.snapeda.com/parts/6437288-2/TE%20Connectivity%20AMP%20Connectors/view-part/?ref=snap; EU_RoHS_Compliance: Compliant; TE_purchase_URL: https://www.te.com/usa-en/product-6437288-2.html?te_bu=Cor&te_type=disp&te_campaign=seda_glo_cor-seda-global-disp-prtnr-fy19-seda-model-bom-cta_sma-317_1&elqCampaignId=32493; MP: 6437288-2; Package: None; Digi-Key_Purchase_URL: https://www.digikey.com/product-detail/en/te-connectivity-amp-connectors/6437288-2/A142477-ND/5428602?utm_source=snapeda&utm_medium=aggregator&utm_campaign=symbol; Digi-Key_Part_Number: A142477-ND; Value: *

## Sheet ShutdownLoop.SchDoc: QUTMS Shutdown V2 - ShutdownLoop
size A3; Organization: QUT Motorsport; Address1: O-120; Address2: O Block; Address3: QUT Gardnes Point; Address4: Brisbane, 4000; DocumentNumber: 2; SheetNumber: 2; SheetTotal: 13
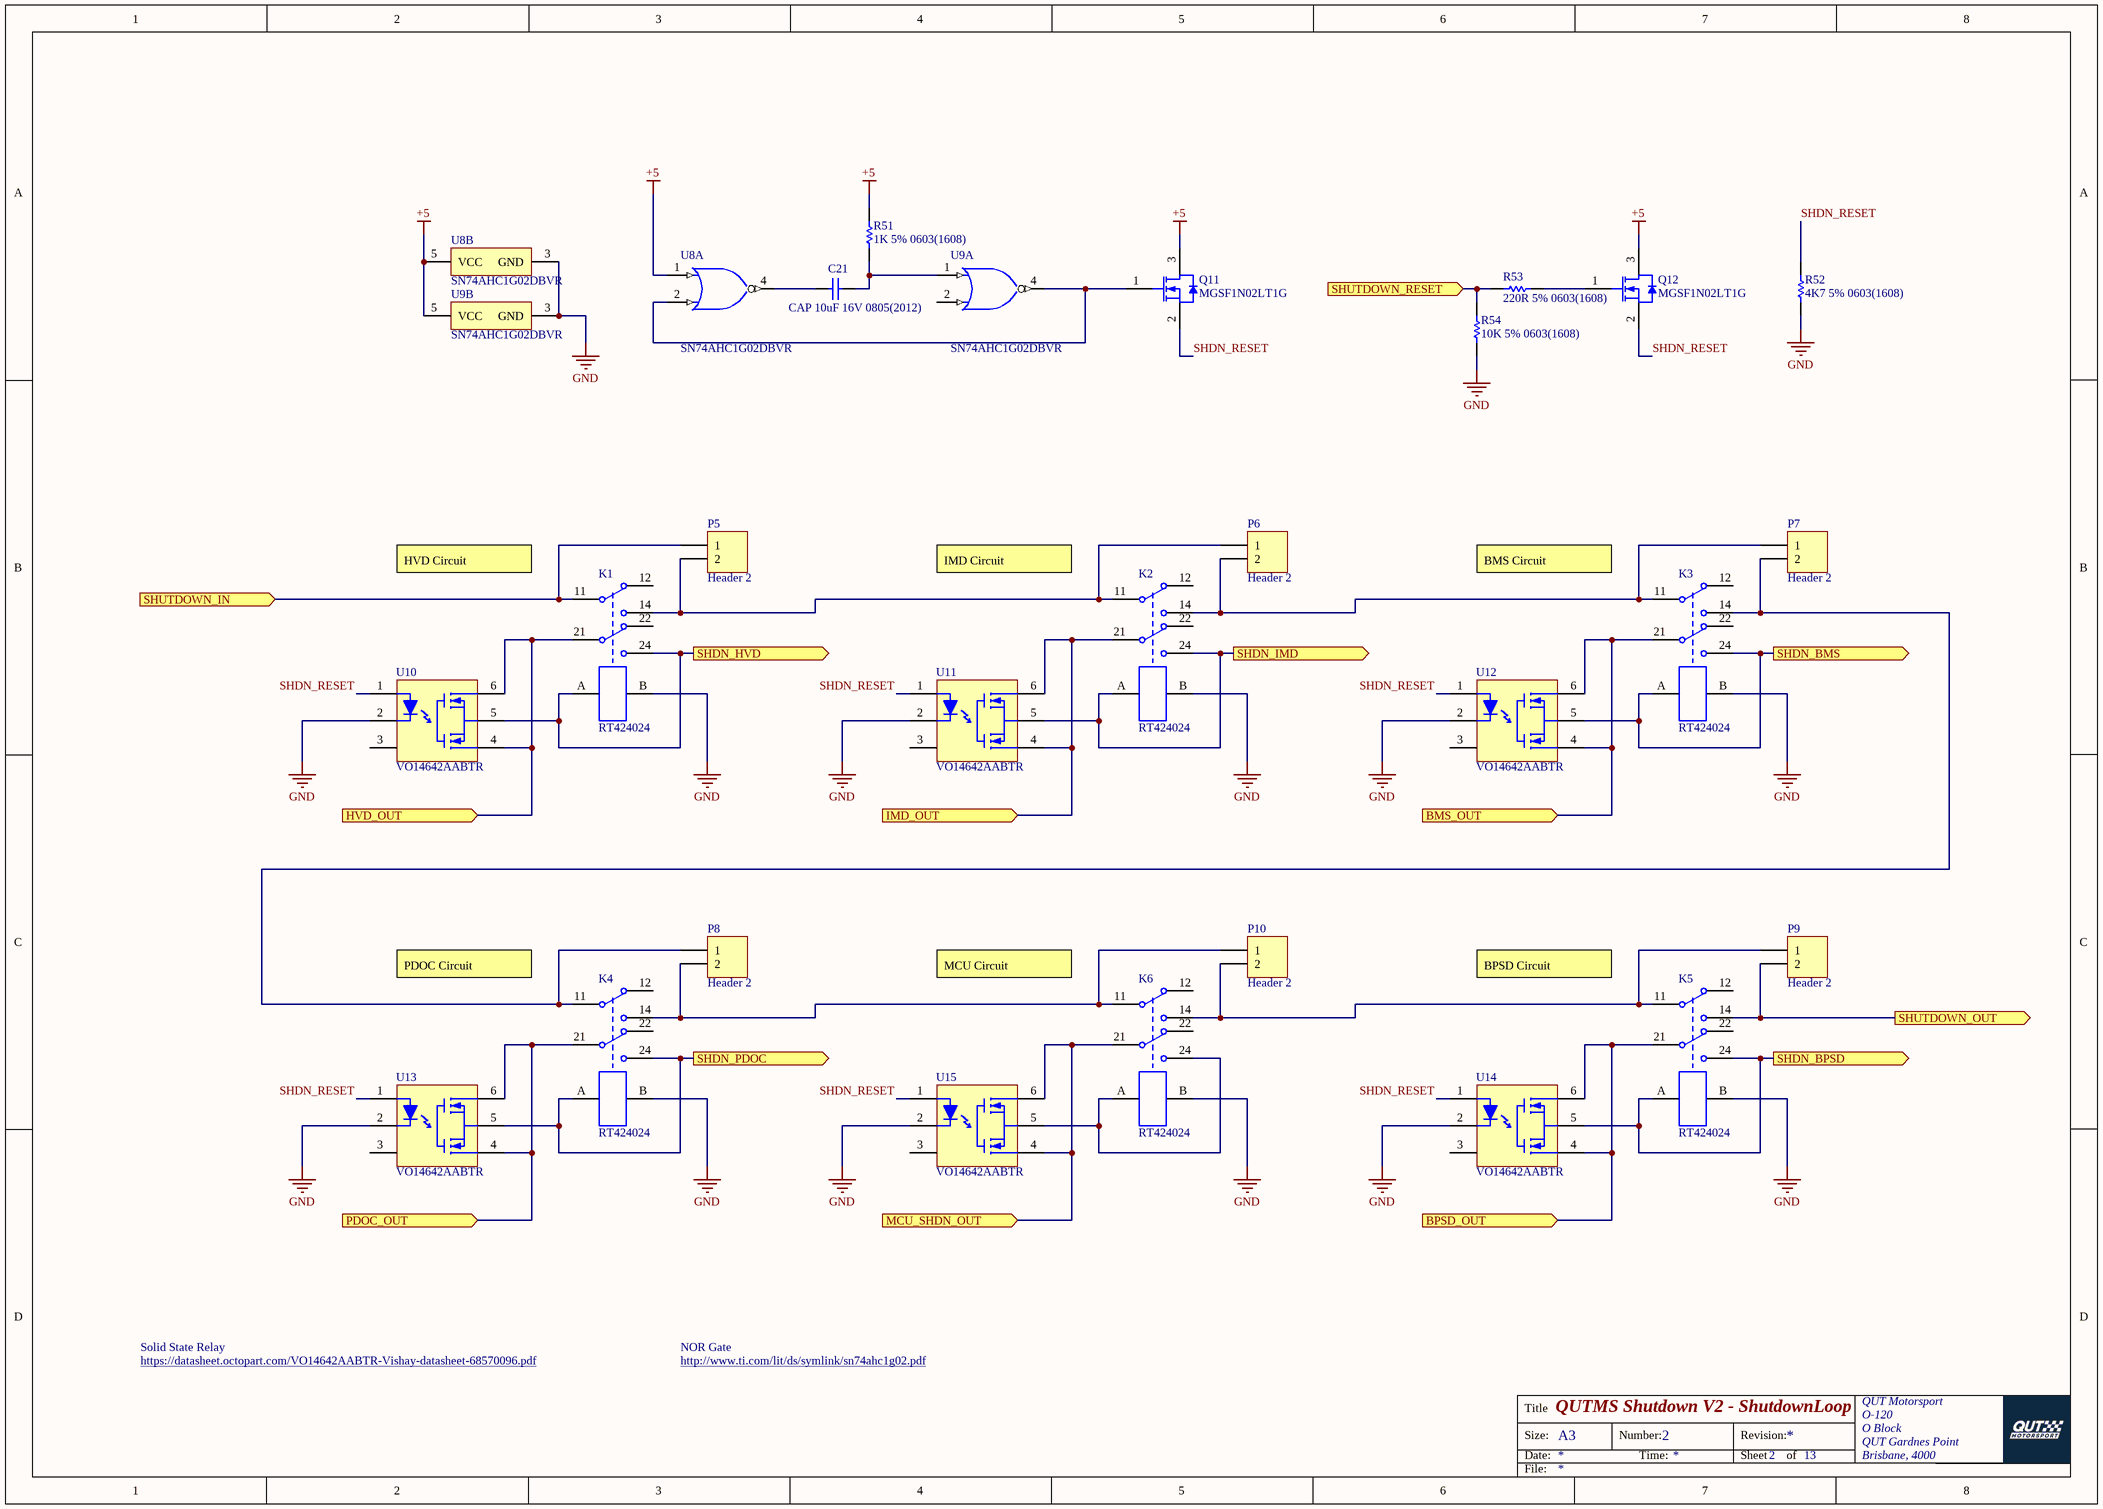
[diagram p8: ShutdownLoop.SchDoc]

### Parts
C21  CAP 10uF 16V 0805(2012)  [CAPC0805(2012)100_L]
K1  RT424024  [TECO-RT424024_V]
K2  RT424024  [TECO-RT424024_V]
K3  RT424024  [TECO-RT424024_V]
K4  RT424024  [TECO-RT424024_V]
K5  RT424024  [TECO-RT424024_V]
K6  RT424024  [TECO-RT424024_V]
P5  Header 2  [HDR1X2]
P6  Header 2  [HDR1X2]
P7  Header 2  [HDR1X2]
P8  Header 2  [HDR1X2]
P9  Header 2  [HDR1X2]
P10  Header 2  [HDR1X2]
Q11  MGSF1N02LT1G  [ONSC-SOT-23-3-318-08_V]
Q12  MGSF1N02LT1G  [ONSC-SOT-23-3-318-08_V]
R51  1K 5% 0603(1608)  [RESC0603(1608)_L]
R52  4K7 5% 0603(1608)  [RESC0603(1608)_N]
R53  220R 5% 0603(1608)  [RESC0603(1608)_M]
R54  10K 5% 0603(1608)  [RESC0603(1608)_N]
U8  SN74AHC1G02DBVR  [DBV0005A_L]  (parts A,B of 2)
U9  SN74AHC1G02DBVR  [DBV0005A_L]  (parts A,B of 2)
U10  VO14642AABTR  [VISH-VO14642AABTR_V]
U11  VO14642AABTR  [VISH-VO14642AABTR_V]
U12  VO14642AABTR  [VISH-VO14642AABTR_V]
U13  VO14642AABTR  [VISH-VO14642AABTR_V]
U14  VO14642AABTR  [VISH-VO14642AABTR_V]
U15  VO14642AABTR  [VISH-VO14642AABTR_V]

### Ports
BMS_OUT (in), BPSD_OUT (in), HVD_OUT (in), IMD_OUT (in), MCU_SHDN_OUT (in), PDOC_OUT (in), SHDN_BMS (out), SHDN_BPSD (out), SHDN_HVD (out), SHDN_IMD (out), SHDN_PDOC (out), SHUTDOWN_IN (in), SHUTDOWN_OUT (out), SHUTDOWN_RESET (in)

### Nets
+5: Q11.3(D) Q12.3(D) R51.2 U8.1(A) U8.5(VCC) U9.5(VCC)
GND: K1.B K2.B K3.B K4.B K5.B K6.B R52.1 R54.1 U8.3(GND) U9.3(GND) U10.2(K) U11.2(K) U12.2(K) U13.2(K) U14.2(K) U15.2(K)
SHDN_BMS: K3.24 K3.A U12.5(DC) ; port SHDN_BMS
SHDN_BPSD: K5.24 K5.A U14.5(DC) ; port SHDN_BPSD
SHDN_HVD: K1.24 K1.A U10.5(DC) ; port SHDN_HVD
SHDN_IMD: K2.24 K2.A U11.5(DC) ; port SHDN_IMD
SHDN_PDOC: K4.24 K4.A U13.5(DC) ; port SHDN_PDOC
SHDN_RESET: Q11.2(S) Q12.2(S) R52.2 U10.1(A) U11.1(A) U12.1(A) U13.1(A) U14.1(A) U15.1(A)
SHUTDOWN_IN: K1.11 P5.1 ; port SHUTDOWN_IN
SHUTDOWN_OUT: K5.14 P9.2 ; port SHUTDOWN_OUT
SHUTDOWN_RESET: R53.1 R54.2 ; port SHUTDOWN_RESET
NetC21_1: C21.1 U8.4(Y)
NetC21_2: C21.2 R51.1 U9.1(A)
NetK1_14: K1.14 K2.11 P5.2 P6.1
NetK1_21: K1.21 U10.4(S') U10.6(S) ; port HVD_OUT
NetK2_14: K2.14 K3.11 P6.2 P7.1
NetK2_21: K2.21 U11.4(S') U11.6(S) ; port IMD_OUT
NetK3_14: K3.14 K4.11 P7.2 P8.1
NetK3_21: K3.21 U12.4(S') U12.6(S) ; port BMS_OUT
NetK4_14: K4.14 K6.11 P8.2 P10.1
NetK4_21: K4.21 U13.4(S') U13.6(S) ; port PDOC_OUT
NetK5_11: K5.11 K6.14 P9.1 P10.2
NetK5_21: K5.21 U14.4(S') U14.6(S) ; port BPSD_OUT
NetK6_21: K6.21 U15.4(S') U15.6(S) ; port MCU_SHDN_OUT
NetK6_24: K6.24 K6.A U15.5(DC)
NetQ11_1: Q11.1(G) U8.2(B) U9.4(Y)
NetQ12_1: Q12.1(G) R53.2

Not connected (* = marked no-connect by the designer): K1 12 22; K2 12 22; K3 12 22; K4 12 22; K5 12 22; K6 12 22; U9 2(B); U10 3(NC); U11 3(NC); U12 3(NC); U13 3(NC); U14 3(NC); U15 3(NC)

### Notes on the sheet
- HVD Circuit
- IMD Circuit
- BMS Circuit
- PDOC Circuit
- MCU Circuit
- BPSD Circuit
- https://datasheet.octopart.com/VO14642AABTR-Vishay-datasheet-68570096.pdf
- Solid State Relay
- http://www.ti.com/lit/ds/symlink/sn74ahc1g02.pdf
- NOR Gate
- Title
- Size:
- Date:
- A3
- Number:
- Time:
- Revision:
- Sheet
- of
- File:

### Library data of the parts
C21 = CMP-1036-04928-1: CAP 10uF 16V ±10% 0805 (2012 Metric) Thickness 1mm SMD; Tolerance: Â±10%; Case-Metric: 2012; Case-EIA: 0805; Rated Voltage: 16 V; Technology: SMT; Max Thickness: 1 mm; Value: 10uF
K1-K6 = CMP-2000-06999-1: DPDT 2 Form C (CO) Low Power PCB Relay, 24 VDC, 8 A, -40 to 85 degC, 8-Pin THD, RoHS, Tube; Manufacturer: TE Connectivity; Contact Form: 2FormC(DPDT-BM); Coil Current: 16.7mA; Coil Voltage: 24V; Coil Resistance: 1440Ohms; Contact Current Rating: 8A; Datasheet URL: http://www.te.com/commerce/DocumentDelivery/DDEController?Action=showdoc&DocId=Data+Sheet%7FRT2%7F1014%7Fpdf%7FEnglish%7FENG_DS_RT2_1014.pdf%7F6-1393243-8; Contact Material: SilverNickel; Datasheet Version: 10/2014; Package Description: 8-Pin Through Hole Device, Body 29 x 12.7 mm, Height 15.7 mm; Package Reference: RT424024; Mounting Style: ThroughHole; Mounting Technology: ThroughHole; Manufacturer URL: http://www.te.com/
P5-P10 = Header 2: Header, 2-Pin; LatestRevisionDate: 17-Jul-2002; LatestRevisionNote: Re-released for DXP Platform.; Publisher: Altium Limited
Q11 Q12 = CMP-1058-00777-1: as Q4 on sheet HVD_Filtering; PackageReference: SOT-23-3-318-08; ComponentLink2Description: Datasheet; PackageVersion: Rev. AP, 11/2009; ComponentLink1URL: http://www.onsemi.com/; RoHS: Pb-Free; Mounting Technology: Surface Mount; Package Type: SOT-23-3; ComponentLink1Description: Manufacturer URL; V(BR)DSS Min (V): 20; PackageDescription: 3-Pin Small Outline Transistor, Body 2.92 x 1.3 mm, Pitch 0.95 mm; Packing: Tape and Reel; PartNumber: MGSF1N02LT1G; DatasheetVersion: Rev. 6; ComponentLink2URL: http://www.onsemi.cn/pub_link/Collateral/MGSF1N02LT1-D.PDF; ComponentLink3URL: http://www.onsemi.cn/pub_link/Collateral/318-08.PDF; ComponentLink3Description: Package Specification
R51 = CMP-1012-00074-1: 1K 0.1W 5% 0603 (1608 Metric)  SMD; Case-EIA: 0603; Case-Metric: 1608; Value: 1000.00 Ohm; Technology: SMT; Tolerance: 5 %; Power: 0.1 W
R52 = CMP-1012-00090-1: as R30 on sheet HVD_Filtering; Tolerance: 5 %; Technology: SMT; Power: 0.1 W
R53 = CMP-1012-00058-1: as R32 on sheet HVD_Filtering; Technology: SMT; Power: 0.1 W; Tolerance: 5 %
R54 = CMP-1012-00098-1: as R29 on sheet HVD_Filtering; Technology: SMT; Tolerance: 5 %; Power: 0.1 W
U8 U9 = CMP-0859-00024-3: as U2 on sheet BSPD_System; DatasheetVersion: SCLS342M; Input Type: CMOS; Operating Temperature Range(C): -40 to 125,-40 to 85; Generic Part Number: SN74AHC1G02; PackageReference: DBV0005A; Schmitt Trigger: No
U10-U15 = CMP-2000-07398-1: 1 Form A Solid State Relay, 2 A, -40 to 85 degC, 6-Pin SMD, RoHS, Tape and Reel; Manufacturer: Vishay; Voltage - Input: 1.3VDC; Load Current: 2A; On-State Resistance: 250mOhm; Dynamic Catalog: VO14; Circuit: SPST-NO(1FormA); Output Type: AC,DC; Voltage - Load: 0~60V; Termination Style: GullWing; Standard Package: 1,000; Quantity Available: Tape&Reel(TR); Supplier Device Package: 6-SMD; Package Description: 6-Pin Surface Mount Device, Body 8.6 x 6.4 mm, Pitch 2.54 mm; Datasheet URL: https://datasheet.ciiva.com/26817/getdatasheetpartid-484357-26817425.pdf; Package / Case: 6-SMD(0.300",7.62mm); Manufacturer URL: http://www.vishay.com/; Relay Type: Relay; Category: Relays; Package Reference: VO14642AABTR; Minimum Quantity: SPST-NO(1FormA); Online Catalog: VO14; Datasheet Version: Rev. 1.5, 04/2011; Family: SolidStateRelays; Mounting Type: SurfaceMount; Packaging: Tape&Reel(TR); Mounting Technology: SurfaceMount

## Sheet MCU.SchDoc: QUTMS Shutdown V2 - MCU
size A4; Author: Jonn Dillon; Organization: QUT Motorsport; Address1: O-120; Address2: O Block; Address3: QUT Gardens Point; Address4: Brisbane, 4000; DocumentNumber: 12; SheetNumber: 12; SheetTotal: 13
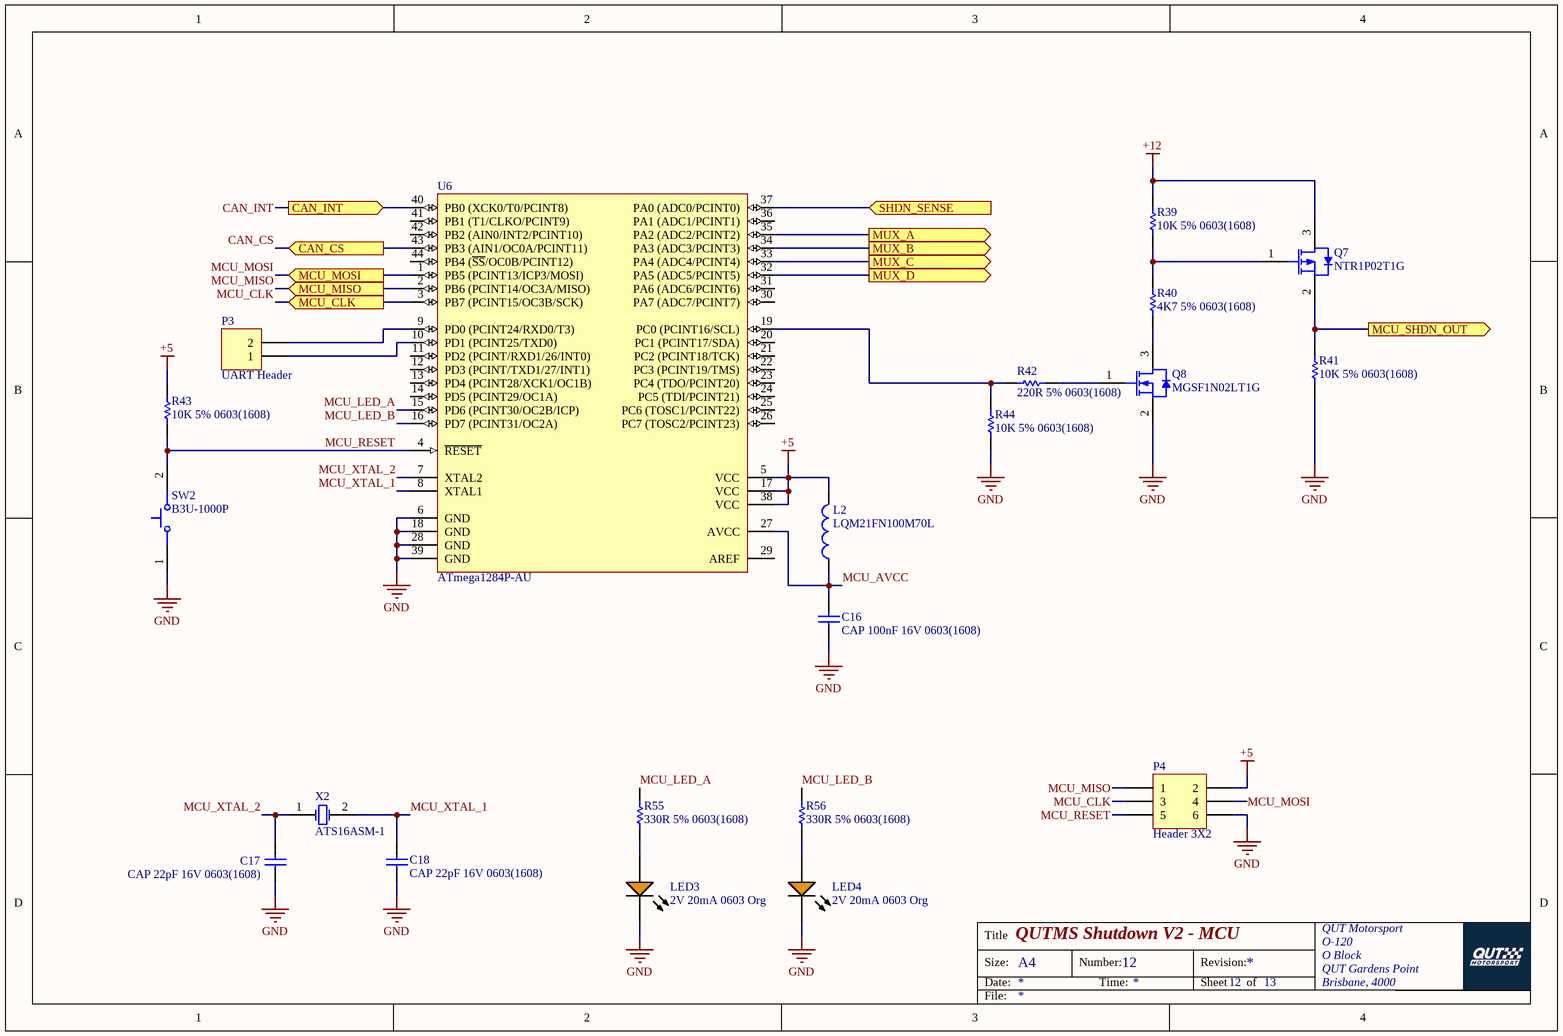
[diagram p9: MCU.SchDoc]

### Parts
C16  CAP 100nF 16V 0603(1608)  [CAPC0603(1608)100_M]
C17  CAP 22pF 16V 0603(1608)  [CAPC0603(1608)100_L]
C18  CAP 22pF 16V 0603(1608)  [CAPC0603(1608)100_L]
L2  LQM21FN100M70L  [MURA-IND0805_L]
LED3  2V 20mA 0603 Org  [KING-LED0603-25-ORANGE_V]
LED4  2V 20mA 0603 Org  [KING-LED0603-25-ORANGE_V]
P3  UART Header  [HDR1X2]
P4  Header 3X2  [HDR2X3]
Q7  NTR1P02T1G  [ONSC-SOT-23-3-318-08_V]
Q8  MGSF1N02LT1G  [ONSC-SOT-23-3-318-08_V]
R39  10K 5% 0603(1608)  [RESC0603(1608)_N]
R40  4K7 5% 0603(1608)  [RESC0603(1608)_N]
R41  10K 5% 0603(1608)  [RESC0603(1608)_N]
R42  220R 5% 0603(1608)  [RESC0603(1608)_M]
R43  10K 5% 0603(1608)  [RESC0603(1608)_N]
R44  10K 5% 0603(1608)  [RESC0603(1608)_N]
R55  330R 5% 0603(1608)  [RESC0603(1608)_L]
R56  330R 5% 0603(1608)  [RESC0603(1608)_L]
SW2  B3U-1000P  [OMRON-B3U-1000_V]
U6  ATmega1284P-AU  [44A_N]
X2  ATS16ASM-1  [CTS-ATS-SM-XTAL-2]

### Ports
CAN_CS (in), CAN_INT (out), MCU_CLK (in), MCU_MISO (in), MCU_MOSI (in), MCU_SHDN_OUT (out), MUX_A (out), MUX_B (out), MUX_C (out), MUX_D (out), SHDN_SENSE (in)

### Nets
+5: L2.2 P4.2 R43.2 U6.5(VCC) U6.17(VCC) U6.38(VCC)
+12: Q7.3(D) R39.2
GND: C16.1 C17.1 C18.1 LED3.2(K) LED4.2(K) P4.6 Q8.2(S) R41.1 R44.1 SW2.1 U6.6(GND) U6.18(GND) U6.28(GND) U6.39(GND)
CAN_CS: U6.43(PB3_(AIN1/OC0A/PCINT11)) ; port CAN_CS
CAN_INT: U6.40(PB0_(XCK0/T0/PCINT8)) ; port CAN_INT
MCU_AVCC: C16.2 L2.1 U6.27(AVCC)
MCU_CLK: P4.3 U6.3(PB7_(PCINT15/OC3B/SCK)) ; port MCU_CLK
MCU_LED_A: R55.1 U6.15(PD6_(PCINT30/OC2B/ICP))
MCU_LED_B: R56.1 U6.16(PD7_(PCINT31/OC2A))
MCU_MISO: P4.1 U6.2(PB6_(PCINT14/OC3A/MISO)) ; port MCU_MISO
MCU_MOSI: P4.4 U6.1(PB5_(PCINT13/ICP3/MOSI)) ; port MCU_MOSI
MCU_RESET: P4.5 R43.1 SW2.2 U6.4(~{RESET})
MCU_XTAL_1: C18.2 U6.8(XTAL1) X2.2(X2)
MCU_XTAL_2: C17.2 U6.7(XTAL2) X2.1(X1)
NetK6_21: Q7.2(S) R41.2 ; port MCU_SHDN_OUT
NetLED3_1: LED3.1(A) R55.2
NetLED4_1: LED4.1(A) R56.2
NetP3_1: P3.1 U6.10(PD1_(PCINT25/TXD0))
NetP3_2: P3.2 U6.9(PD0_(PCINT24/RXD0/T3))
NetQ7_1: Q7.1(G) R39.1 R40.2
NetQ8_1: Q8.1(G) R42.2
NetQ8_3: Q8.3(D) R40.1
NetR27_1: U6.37(PA0_(ADC0/PCINT0)) ; port SHDN_SENSE
NetR42_1: R42.1 R44.2 U6.19(PC0_(PCINT16/SCL))
NetU5_10: U6.35(PA2_(ADC2/PCINT2)) ; port MUX_A
NetU5_11: U6.34(PA3_(ADC3/PCINT3)) ; port MUX_B
NetU5_13: U6.32(PA5_(ADC5/PCINT5)) ; port MUX_D
NetU5_14: U6.33(PA4_(ADC4/PCINT4)) ; port MUX_C

Not connected (* = marked no-connect by the designer): U6 11(PD2_(PCINT/RXD1/26/INT0)) 12(PD3_(PCINT/TXD1/27/INT1)) 13(PD4_(PCINT28/XCK1/OC1B)) 14(PD5_(PCINT29/OC1A)) 20(PC1_(PCINT17/SDA)) 21(PC2_(PCINT18/TCK)) 22(PC3_(PCINT19/TMS)) 23(PC4_(TDO/PCINT20)) 24(PC5_(TDI/PCINT21)) 25(PC6_(TOSC1/PCINT22)) 26(PC7_(TOSC2/PCINT23)) 29(AREF) 30(PA7_(ADC7/PCINT7)) 31(PA6_(ADC6/PCINT6)) 36(PA1_(ADC1/PCINT1)) 41(PB1_(T1/CLKO/PCINT9)) 42(PB2_(AIN0/INT2/PCINT10)) 44(PB4_(~{SS}/OC0B/PCINT12))

### Notes on the sheet
- Title
- Size:
- Date:
- A4
- Number:
- Time:
- Revision:
- Sheet
- of
- File:

### Library data of the parts
C16 = CMP-1035-02583-1: as C1 on sheet BSPD_System; Rated Voltage: 16 V; Max Thickness: 1 mm; Technology: SMT; Value: 100nF
C17 C18 = CMP-1035-00806-1: CAP 22pF 16V ±1% 0603 (1608 Metric) Thickness 1mm SMD; Tolerance: Â±1%; Case-EIA: 0603; Case-Metric: 1608; Value: 22pF; Max Thickness: 1 mm; Rated Voltage: 16 V; Technology: SMT
L2 = CMP-2000-06587-1: Fixed Inductor, 10 uH, +/-20%, -55 to 125 degC, 2-Pin SMD (0805), RoHS, Tape and Reel; Manufacturer: Murata; Tolerance (%): 20%; DC Resistance: 0.6; Inductance-Nom: 10H; Rated Current-Max: 100mA; Package Reference: IND0805; Case Size/Dimension: 0805; Manufacturer URL: http://www.murata.com/; Package Description: 2-Pin Surface Mount Device, Body 2 x 1.25 mm; Datasheet URL: http://psearch.en.murata.com/inductor/product/LQM21FN100M70%23.pdf; Mounting Technology: SurfaceMount; Datasheet Version: 05/2016
LED3 LED4 = CMP-0239-00002-1: LED, SMT, 0603(1608), 0.25mm Tthickness, Super Bright Orange; PartNumber: APG1608SEKC/T; Forward Current: 30 mA; Power Dissipation: 75 mW; Reverse Voltage: 5 V; Packing: Reel; PackageDescription: 2-Pin SMT LED, 1.6 x 0.8 mm Body, 0.25mm Thickness; ComponentLink1URL: http://www.kingbrightusa.com/; PackageVersion: Rev. 4A, 12/2011; Storage Temperature: -40 to 85 degC; Mounting Technology: Surface Mount; ComponentLink2Description: Datasheet; DatasheetVersion: Rev. 4A, 12/2011; ComponentLink2URL: http://www.kingbrightusa.com/images/catalog/SPEC/APG1608SEKC-T.pdf; PackageReference: LED0603-25-ORANGE; ComponentLink1Description: Manufacturer URL
P3 = Header 2: LatestRevisionDate: 17-Jul-2002; LatestRevisionNote: Re-released for DXP Platform.; Publisher: Altium Limited
P4 = Header 3X2: Header, 3-Pin, Dual row; LatestRevisionDate: 17-Jul-2002; LatestRevisionNote: Re-released for DXP Platform.; Publisher: Altium Limited
Q7 = CMP-1058-00751-1: as Q3 on sheet HVD_Filtering; ComponentLink2Description: Datasheet; ComponentLink3URL: http://www.onsemi.cn/pub_link/Collateral/318-08.PDF; PackageReference: SOT-23-3-318-08; ComponentLink1Description: Manufacturer URL; Mounting Technology: Surface Mount; RoHS: Pb-Free; Package Type: SOT-23-3; DatasheetVersion: Rev. 7; PackageVersion: Rev. AP, 11/2009; Packing: Tape and Reel; PackageDescription: 3-Pin Small Outline Transistor, Body 2.92 x 1.3 mm, Pitch 0.95 mm; VGS Max (V): 20; ComponentLink3Description: Package Specification; ComponentLink1URL: http://www.onsemi.com/; PartNumber: NTR1P02T1G; ComponentLink2URL: http://www.onsemi.cn/pub_link/Collateral/NTR1P02T1-D.PDF
Q8 = CMP-1058-00777-1: as Q4 on sheet HVD_Filtering; PackageReference: SOT-23-3-318-08; ComponentLink2Description: Datasheet; PackageVersion: Rev. AP, 11/2009; ComponentLink1URL: http://www.onsemi.com/; RoHS: Pb-Free; Mounting Technology: Surface Mount; Package Type: SOT-23-3; ComponentLink1Description: Manufacturer URL; V(BR)DSS Min (V): 20; PackageDescription: 3-Pin Small Outline Transistor, Body 2.92 x 1.3 mm, Pitch 0.95 mm; Packing: Tape and Reel; PartNumber: MGSF1N02LT1G; DatasheetVersion: Rev. 6; ComponentLink2URL: http://www.onsemi.cn/pub_link/Collateral/MGSF1N02LT1-D.PDF; ComponentLink3URL: http://www.onsemi.cn/pub_link/Collateral/318-08.PDF; ComponentLink3Description: Package Specification
R39 R41 R43 R44 = CMP-1012-00098-1: as R29 on sheet HVD_Filtering; Technology: SMT; Tolerance: 5 %; Power: 0.1 W
R40 = CMP-1012-00090-1: as R30 on sheet HVD_Filtering; Tolerance: 5 %; Technology: SMT; Power: 0.1 W
R42 = CMP-1012-00058-1: as R32 on sheet HVD_Filtering; Technology: SMT; Power: 0.1 W; Tolerance: 5 %
R55 R56 = CMP-1012-00062-1: 330R 0.1W 5% 0603 (1608 Metric)  SMD; Value: 330.00 Ohm; Case-EIA: 0603; Case-Metric: 1608; Tolerance: 5 %; Power: 0.1 W; Technology: SMT
SW2 = CMP-2100-03586-1: Ultra-Small Tactile Switch, 0.05 A, 12 V, -25 to 70 degC, 2-Pin SMD, RoHS, Tape and Reel; Manufacturer: Omron Electronic Components; Operating Force: 1.5N; Current Rating: 50mA; Voltage Rating (DC): 12V; Electrical Life: 200000Cycles; Actuator Length: 0.4mm; Insulation Resistance: 100MOhm; Switch Travel: 0.15mm; Throw Configuration: SPST; Illumination Type: Illuminated; Width: 3mm; Weight: 0.022g; Datasheet Version: 42005.0; Datasheet URL: http://www.omron.com/ecb/products/pdf/en-b3u.pdf; Height: 1.2mm; Package Quantity: 1; REACH SVHC: Unknown; Contact Current Rating: 50mA; Contact Material: Silver; Max Current Rating: 50mA; Package Reference: B3U-1000; Termination: SMD/SMT; Packaging: TapeandReel; Manufacturer URL: http://www.omron.com/; RoHSCompliant: true; Mount: SurfaceMount; Length: 4mm; Min Operating Temperature: -25degC; Depth: 2.5mm; Lead Free: LeadFree; Case/Package: SMD/SMT; Package Description: 2-Pin Surface Mount Device, Body 3 x 2.5 mm; Max Operating Temperature: 70degC; Orientation: Straight
U6 = CMP-0095-00577-1: 8-bit AVR Microcontroller, 128KB Flash, 4KB EEPROM, 16KB SRAM, 44-pin TQFP, Industrial Grade (-40°C to 85°C); PackageReference: 44A; Code_JEDEC: MS-026-ACB; ComponentLink3Description: ATmega164A/164PA/324A/324PA/644A/644PA/1284/1284P Summary; DatasheetVersion: revC, Jun-2011; PackageDescription: 44-Pin Plastic Thin Profile Quad Flat Pack, 10 x 10 x 1.0 mm Body, 0.8 mm Pitch (TQFP); ComponentLink3URL: http://www.atmel.com/dyn/resources/prod_documents/8272S.pdf; ComponentLink1URL: http://www.atmel.com/; ComponentLink1Description: Manufacturer URL; ComponentLink2Description: ATmega164A/164PA/324A/324PA/644A/644PA/1284/1284P Datasheet; ComponentLink2URL: http://www.atmel.com/dyn/resources/prod_documents/doc8272.pdf; PackageVersion: revC, Oct-2010
X2 = CMP-0585-00002-2: ATS-SM Series Quartz Crystal, 16 MHz, -20 to 70 degC, 11.1 x 4.83 x 4.3mm SMD, RoHS, Tape and Reel; Manufacturer: CTS Corporation; Shunt Capacitance (C0): 7.0 pF Max; Frequency: 16 MHz; Oscillation Mode: Fundamental or 3rd Overtone; Crystal Cut: AT-Cut; ESR Maximum: 40 Ohms; Drive Level (Type): 100 uW; PackageDescription: 2-Pin SMD, Body 11.1 x 4.83 mm, Pitch 8.5 mm; PackageReference: ATS-SM-XTAL-2; ComponentLink1URL: http://www.ctscorp.com/; PartNumber: ATS16ASM-1; RoHS: TRUE; ComponentLink1Description: Manufacturer URL; Operating Temperature: -20 to 70 degC; DatasheetVersion: Rev. K; ComponentLink2Description: Datasheet; Packing: Tape and Reel; ComponentLink2URL: http://www.ctscorp.com/components/Datasheets/008-0309-0.pdf; Mounting Technology: Surface Mount; ComponentLink3URL: http://www.ctscorp.com/components/Datasheets/008-0309-0.pdf; ComponentLink3Description: Package Specification

## Sheet CAN.SchDoc: QUTMS Shutdown V2 - CANBUS
size A4; Author: Jonn Dillon; Organization: QUT Motorsport; Address1: O-120; Address2: O Block; Address3: QUT Gardens Point; Address4: Brisbane, 4000; DocumentNumber: 11; SheetNumber: 11; SheetTotal: 13
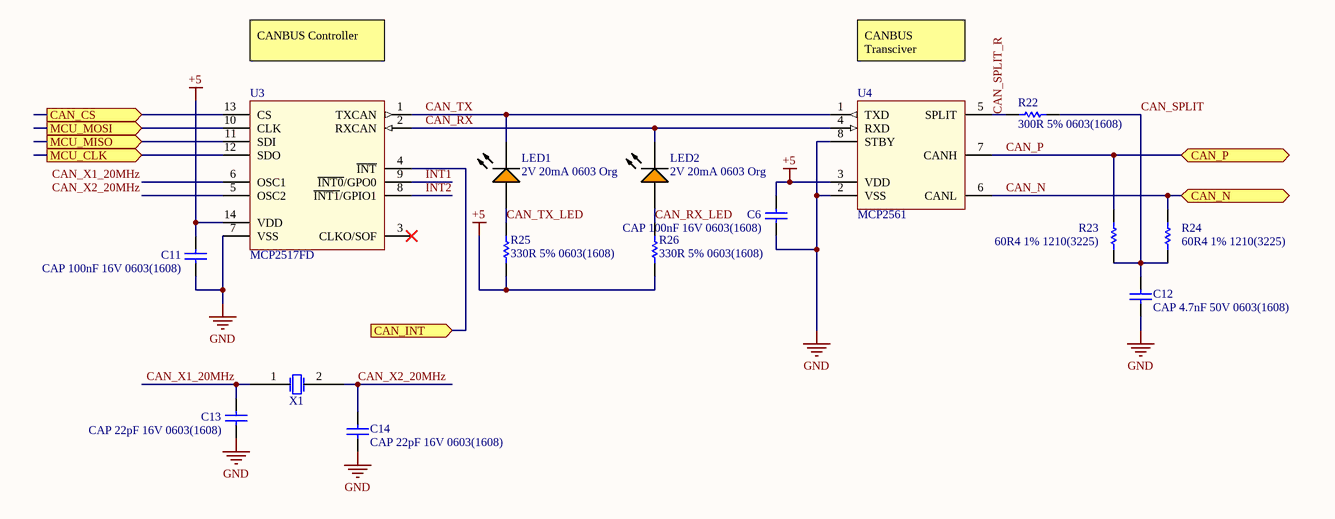
[diagram p10: CAN.SchDoc]

### Parts
C6  CAP 100nF 16V 0603(1608)  [CAPC0603(1608)100_N]
C11  CAP 100nF 16V 0603(1608)  [CAPC0603(1608)100_N]
C12  CAP 4.7nF 50V 0603(1608)  [CAPC0603(1608)100_M]
C13  CAP 22pF 16V 0603(1608)  [CAPC0603(1608)100_N]
C14  CAP 22pF 16V 0603(1608)  [CAPC0603(1608)100_N]
LED1  2V 20mA 0603 Org  [KING-LED0603-25-ORANGE_V]
LED2  2V 20mA 0603 Org  [KING-LED0603-25-ORANGE_V]
R22  300R 5% 0603(1608)  [RESC0603(1608)_N]
R23  60R4 1% 1210(3225)  [RESC1210(3225)_L]
R24  60R4 1% 1210(3225)  [RESC1210(3225)_L]
R25  330R 5% 0603(1608)  [RESC0603(1608)_L]
R26  330R 5% 0603(1608)  [RESC0603(1608)_L]
U3  MCP2517FD  [MCP2517FD SOIC]
U4  MCP2561  [MCP2561 SOIC]
X1  Crystal 20MHz  [Crystal 20MHz]  (value not drawn)

### Ports
CAN_CS (out), CAN_INT (in), CAN_N (bidir), CAN_P (bidir), MCU_CLK (out), MCU_MISO (out), MCU_MOSI (out)

### Nets
+5: C6.2 C11.2 R25.1 R26.1 U3.14(VDD) U4.3(VDD)
GND: C6.1 C11.1 C12.1 C13.1 C14.2 U3.7(VSS) U4.2(VSS) U4.8(STBY)
CAN_N: R24.2 U4.6(CANL) ; port CAN_N
CAN_P: R23.2 U4.7(CANH) ; port CAN_P
CAN_RX: LED2.2(K) U3.2(RXCAN) U4.4(RXD)
CAN_RX_LED: LED2.1(A) R26.2
CAN_SPLIT: C12.2 R22.2 R23.1 R24.1
CAN_SPLIT_R: R22.1 U4.5(SPLIT)
CAN_TX: LED1.2(K) U3.1(TXCAN) U4.1(TXD)
CAN_TX_LED: LED1.1(A) R25.2
CAN_X1_20MHz: C13.2 U3.6(OSC1) X1.1
CAN_X2_20MHz: C14.1 U3.5(OSC2) X1.2
INT1: U3.9(~{INT0}/GPO0)
INT2: U3.8(~{INT1}/GPIO1)
NetU3_4: U3.4(~{INT}) ; port CAN_INT
NetU3_10: U3.10(CLK) ; port MCU_MOSI
NetU3_11: U3.11(SDI) ; port MCU_MISO
NetU3_12: U3.12(SDO) ; port MCU_CLK
NetU3_13: U3.13(CS) ; port CAN_CS

Not connected (* = marked no-connect by the designer): U3 3(CLKO/SOF)*

### Notes on the sheet
- CANBUS Controller
- CANBUS Transciver
- Title
- Size:
- Date:
- A4
- Number:
- Time:
- Revision:
- Sheet
- of
- File:

### Library data of the parts
C6 C11 = CMP-1035-02584-1: CAP 100nF 16V ±10% 0603 (1608 Metric) Thickness 1mm SMD; Tolerance: Â±10%; Case-EIA: 0603; Case-Metric: 1608; Technology: SMT; Max Thickness: 1 mm; Value: 100nF; Rated Voltage: 16 V
C12 = CMP-1035-02202-1: CAP 4.7nF 50V ±5% 0603 (1608 Metric) Thickness 1mm SMD; Case-Metric: 1608; Case-EIA: 0603; Tolerance: Â±5%; Value: 4.7nF; Rated Voltage: 50 V; Technology: SMT; Max Thickness: 1 mm
C13 C14 = CMP-1035-00808-1: CAP 22pF 16V ±5% 0603 (1608 Metric) Thickness 1mm SMD; Tolerance: Â±5%; Case-EIA: 0603; Case-Metric: 1608; Technology: SMT; Value: 22pF; Rated Voltage: 16 V; Max Thickness: 1 mm
LED1 LED2 = CMP-0239-00002-1: as LED3 on sheet MCU; PackageDescription: 2-Pin SMT LED, 1.6 x 0.8 mm Body, 0.25mm Thickness; ComponentLink1URL: http://www.kingbrightusa.com/; PackageVersion: Rev. 4A, 12/2011; Storage Temperature: -40 to 85 degC; Mounting Technology: Surface Mount; ComponentLink2Description: Datasheet; DatasheetVersion: Rev. 4A, 12/2011; ComponentLink2URL: http://www.kingbrightusa.com/images/catalog/SPEC/APG1608SEKC-T.pdf; PackageReference: LED0603-25-ORANGE; ComponentLink1Description: Manufacturer URL
R22 = CMP-1012-00061-1: 300R 0.1W 5% 0603 (1608 Metric)  SMD; Case-EIA: 0603; Value: 300.00 Ohm; Case-Metric: 1608; Tolerance: 5 %; Power: 0.1 W; Technology: SMT
R23 R24 = CMP-1015-00372-1: 60R4 0.5W 1% 1210 (3225 Metric)  SMD; Case-Metric: 3225; Case-EIA: 1210; Value: 60.40 Ohm; Technology: SMT; Tolerance: 1 %; Power: 0.5 W
R25 R26 = CMP-1012-00062-1: as R55 on sheet MCU; Tolerance: 5 %; Power: 0.1 W; Technology: SMT
X1 = Crystal 20MHz: ComponentLink1Description: Datasheet; ComponentLink1URL: http://cfd.citizen.co.jp/english/prod-tech/product/pdf/datasheet_AT/HCM49_E.pdf